# EAGLE design PoE_mag_main_alt2 (EAGLE 6.4)

## Sheet 1 of 4
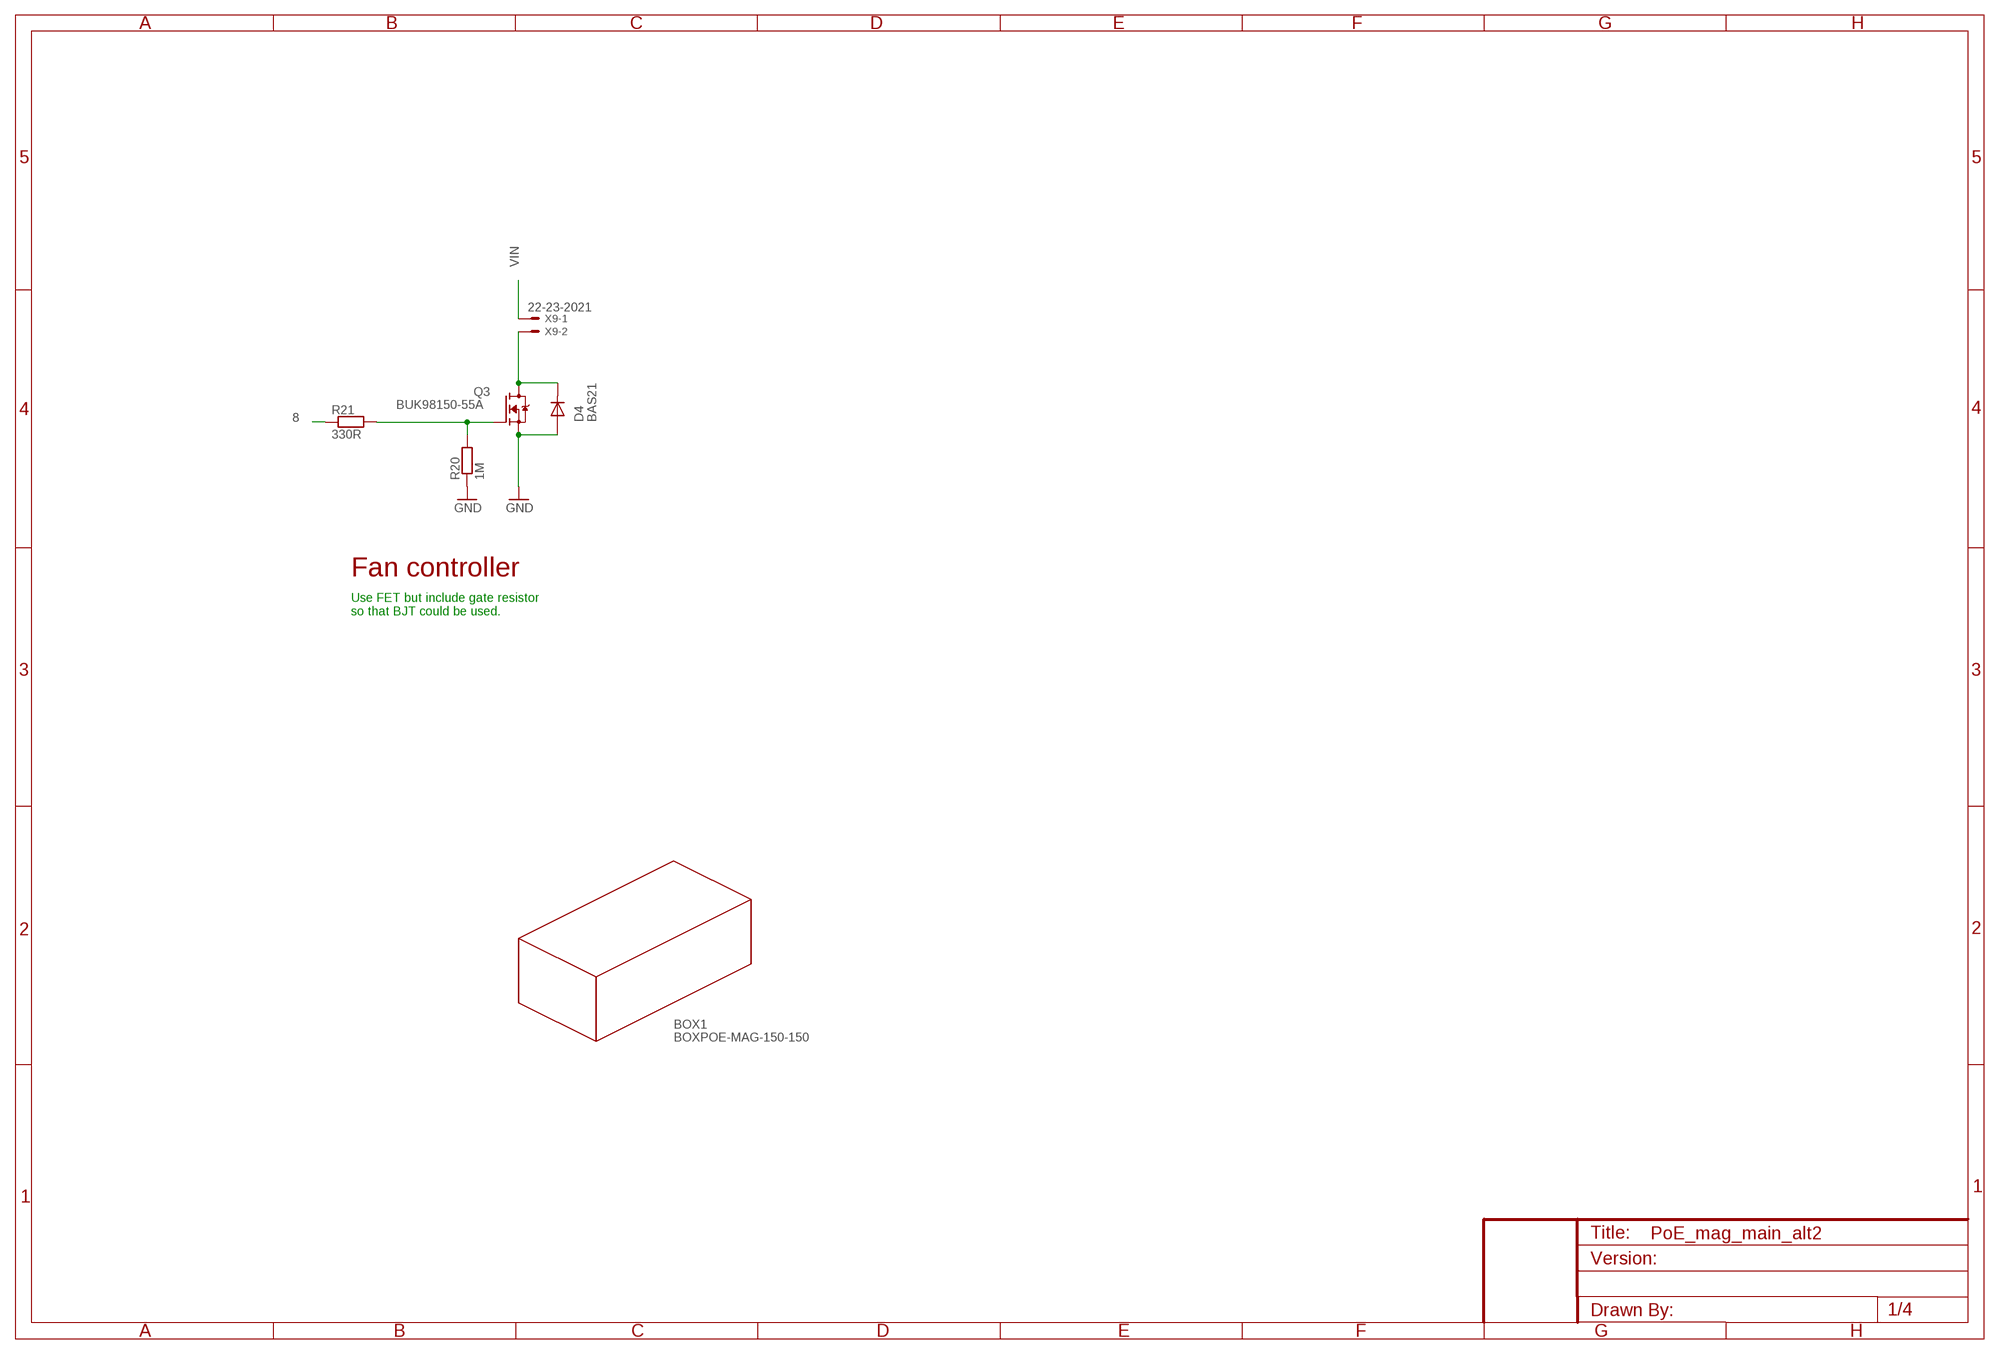
[diagram p0: schematic, sheet 1]

### Parts
BOX1  BOXPOE-MAG-150-150  [FIBOX-PC-M-95-G-POE-MAG]
D4  BAS21  DIODESOT23-1-3-HAND  [SOT23-3-HAND]
Q3  BUK98150-55A  FET-N-TYPESOT223-HAND  [SOT223-HAND]
R20  1M  RESISTOR1206-HAND  [1206-HAND]
R21  330R  RESISTOR1206-HAND  [1206-HAND]
X9  22-23-2021  [22-23-2021]

### Nets
8: R21.1 ; also sheet 2
FAN_CTRL: D4.3(C) Q3.2(D) Q3.4(D) X9.2
GND [power]: D4.1(A) Q3.3(S) R20.1 ; also sheet 2,3,4
N$29: Q3.1(G) R20.2 R21.2
VIN [power]: X9.1 ; also sheet 2,4

### Notes on the sheet
- Fan controller
- Use FET but include gate resistor
  so that BJT could be used.

## Sheet 2 of 4
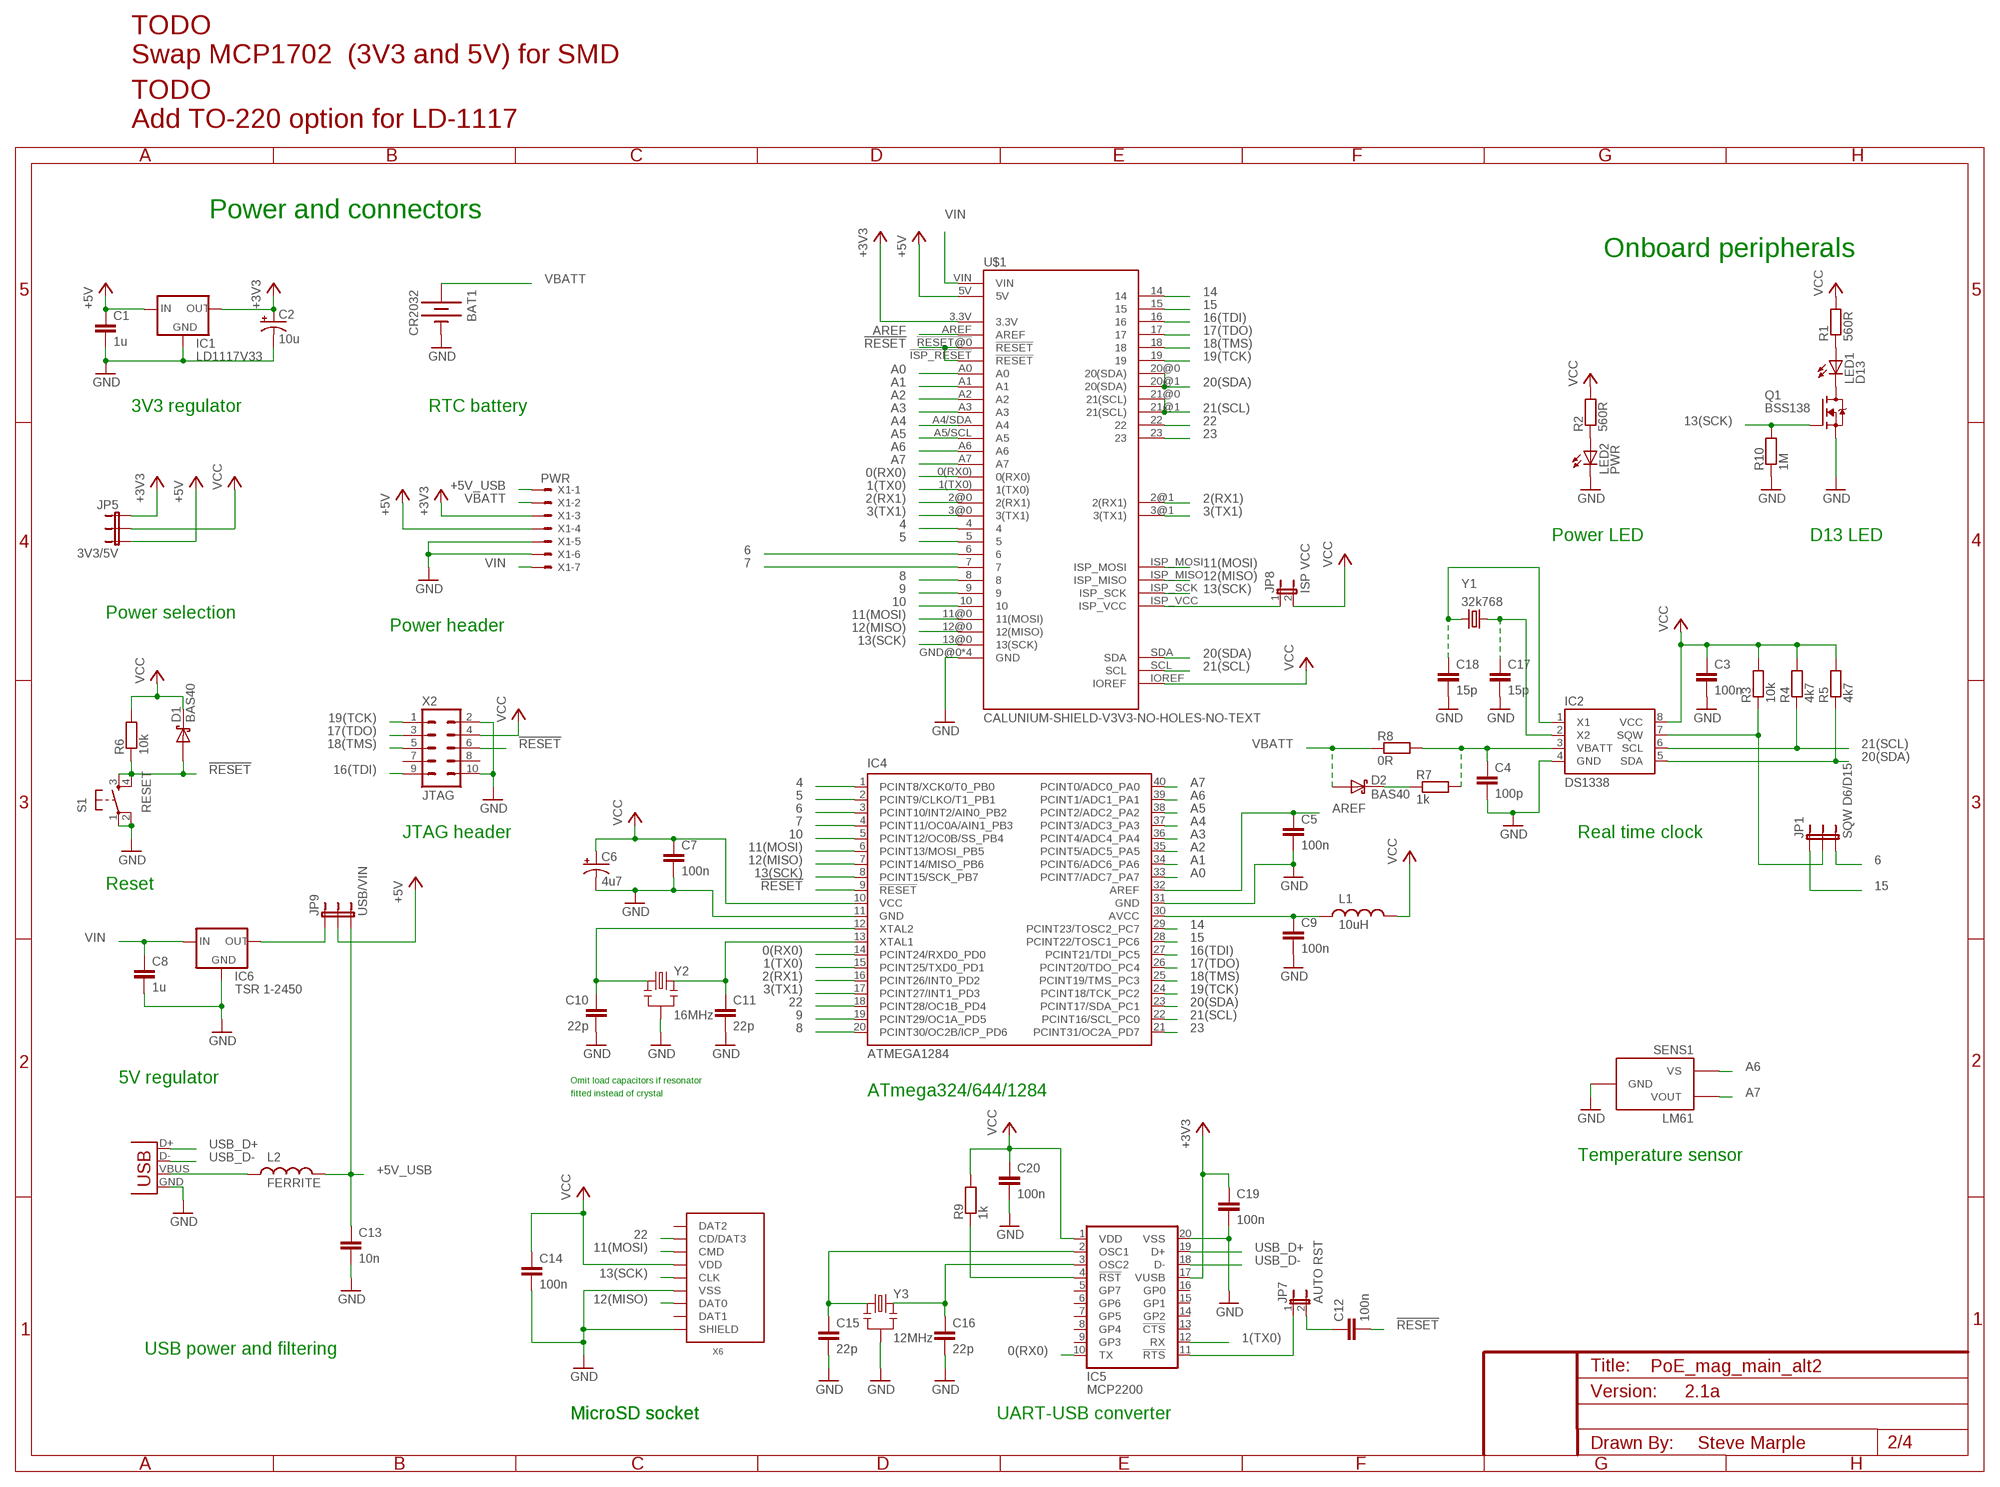
[diagram p1: schematic, sheet 2]

### Parts
BAT1  CR2032  BATTERY20PTH  [BATTCOM_20MM_PTH]
C1  1u  C-EU1206-HAND  [1206-HAND]
C2  10u  CAP_POLPTH2  [CPOL-RADIAL-10UF-25V]
C3  100n  C-EU1206-HAND  [1206-HAND]
C4  100p  C-EU1206-HAND  [1206-HAND]
C5  100n  C-EU1206-HAND  [1206-HAND]
C6  4u7  CAP_POLPTH2  [CPOL-RADIAL-10UF-25V]
C7  100n  C-EU1206-HAND  [1206-HAND]
C8  1u  C-EU1206-HAND  [1206-HAND]
C9  100n  C-EU1206-HAND  [1206-HAND]
C10  22p  C-EU0805-HAND  [0805-HAND]
C11  22p  C-EU0805-HAND  [0805-HAND]
C12  100n  C-EU1206-HAND  [1206-HAND]
C13  10n  C-EU1206-HAND  [1206-HAND]
C14  100n  C-EU1206-HAND  [1206-HAND]
C15  22p  C-EU0805-HAND  [0805-HAND]
C16  22p  C-EU0805-HAND  [0805-HAND]
C17  15p  C-EU0805-HAND  [0805-HAND]
C18  15p  C-EU0805-HAND  [0805-HAND]
C19  100n  C-EU1206-HAND  [1206-HAND]
C20  100n  C-EU1206-HAND  [1206-HAND]
D1  BAS40  DIODE-SCHOTTKYSOT23-1-3-HAND  [SOT23-3-HAND]
D2  BAS40  DIODE-SCHOTTKYSOT23-1-3-HAND  [SOT23-3-HAND]
IC1  LD1117V33  V_REG_LD1117VXXTO220  [TO220]
IC2  DS1338  DS1307SO08  [SO08]
IC4  ATMEGA1284  ATMEGA644-20PU  [DIL40]
IC5  MCP2200  [SO20]
IC6  TSR 1-2450  V_REG_78XXTSR-1-XXXX  [TSR-1-XXXX]
JP1  SQW D6/D15  JUMPER-3PTH  [1X03]
JP5  3V3/5V  JUMPER-3PTH  [1X03]
JP7  AUTO RST  JUMPER-2PTH  [1X02]
JP8  ISP VCC  JUMPER-2PTH  [1X02]
JP9  USB/VIN  JUMPER-3PTH  [1X03]
L1  10uH  INDUCTOR1210-HAND  [1210-HAND]
L2  FERRITE  INDUCTOR0805-HAND  [0805-HAND]
LED1  D13  LED3MM  [LED3MM]
LED2  PWR  LED3MM  [LED3MM]
Q1  BSS138  BSS138SOT23-3-HAND  [SOT23-3-HAND]
R1  560R  RESISTOR1206-HAND  [1206-HAND]
R2  560R  RESISTOR1206-HAND  [1206-HAND]
R3  10k  RESISTOR1206-HAND  [1206-HAND]
R4  4k7  RESISTOR1206-HAND  [1206-HAND]
R5  4k7  RESISTOR1206-HAND  [1206-HAND]
R6  10k  RESISTOR1206-HAND  [1206-HAND]
R7  1k  RESISTOR1206-HAND  [1206-HAND]
R8  0R  RESISTOR1206-HAND  [1206-HAND]
R9  1k  RESISTOR1206-HAND  [1206-HAND]
R10  1M  RESISTOR1206-HAND  [1206-HAND]
S1  RESET  TAC_SWITCHPTH  [TACTILE-PTH]
SENS1  LM61  [TO-92]
U$1  CALUNIUM-SHIELD-V3V3-NO-HOLES-NO-TEXT  [CALUNIUM-SHIELD-NO-OUTLINE-NO-HOLES-NO-TEXT-V3]
X1  PWR  22-23-2071  [22-23-2071]
X2  JTAG  ATMEL-JTAG  [CON-HARTING-ML10]
X3  USB  USBPTH-VERTICAL  [USB-B-PTH-VERTICAL]
X6  MICRO-SD-SOCKETHIROSE-DM3D  [MICRO-SD-SOCKET-HIROSE-DM3D]
Y1  32k768  CRYSTALTC38H  [TC38H]
Y2  16MHz  CRYSTAL-RESONATOR  [HC49U-V-RESONATOR]
Y3  12MHz  CRYSTAL-RESONATOR  [HC49U-V-RESONATOR]

### Nets
0(RX0): IC4.14(PCINT24/RXD0_PD0) IC5.10(TX) U$1.0(RX0)
1(TX0): IC4.15(PCINT25/TXD0_PD1) IC5.12(RX) U$1.1(TX0)
2(RX1): IC4.16(PCINT26/INT0_PD2) U$1.2@0(2(RX1)) U$1.2@1(2(RX1)) ; also sheet 3
3(TX1): IC4.17(PCINT27/INT1_PD3) U$1.3@0(3(TX1)) U$1.3@1(3(TX1)) ; also sheet 3
4: IC4.1(PCINT8/XCK0/T0_PB0) U$1.4
5: IC4.2(PCINT9/CLKO/T1_PB1) U$1.5
6: IC4.3(PCINT10/INT2/AIN0_PB2) JP1.3 U$1.6 ; also sheet 3
7: IC4.4(PCINT11/OC0A/AIN1_PB3) U$1.7 ; also sheet 3
8: IC4.20(PCINT30/OC2B/ICP_PD6) U$1.8 ; also sheet 1
9: IC4.19(PCINT29/OC1A_PD5) U$1.9
10: IC4.5(PCINT12/OC0B/SS_PB4) U$1.10
11(MOSI): IC4.6(PCINT13/MOSI_PB5) U$1.11@0(11(MOSI)) U$1.ISP_MOSI X6.CMD
12(MISO): IC4.7(PCINT14/MISO_PB6) U$1.12@0(12(MISO)) U$1.ISP_MISO X6.DAT0
13(SCK): IC4.8(PCINT15/SCK_PB7) Q1.1(G) R10.2 U$1.13@0(13(SCK)) U$1.ISP_SCK X6.CLK
14: IC4.29(PCINT23/TOSC2_PC7) U$1.14
15: IC4.28(PCINT22/TOSC1_PC6) JP1.1 U$1.15
16(TDI): IC4.27(PCINT21/TDI_PC5) U$1.16 X2.9(TDI)
17(TDO): IC4.26(PCINT20/TDO_PC4) U$1.17 X2.3(TDO)
18(TMS): IC4.25(PCINT19/TMS_PC3) U$1.18 X2.5(TMS)
19(TCK): IC4.24(PCINT18/TCK_PC2) U$1.19 X2.1(TCK)
20(SDA): IC2.5(SDA) IC4.23(PCINT17/SDA_PC1) R5.1 U$1.20@0(20(SDA)) U$1.20@1(20(SDA)) U$1.SDA ; also sheet 4
21(SCL): IC2.6(SCL) IC4.22(PCINT16/SCL_PC0) R4.1 U$1.21@0(21(SCL)) U$1.21@1(21(SCL)) U$1.SCL ; also sheet 4
22: IC4.18(PCINT28/OC1B_PD4) U$1.22 X6.CD/DAT3
23: IC4.21(PCINT31/OC2A_PD7) U$1.23
!MCP2200_RESET: IC5.4(!RST) R9.1
!RESET: C12.2 D1.1(A) IC4.9(!RESET) R6.1 S1.3 S1.4 U$1.!ISP_RESET(!RESET) U$1.!RESET@0(!RESET) X2.6(!SRST)
+3V3 [power]: C2.1(+) C19.1 IC1.2(OUT) IC5.17(VUSB) JP5.1 U$1.3.3V X1.3 ; also sheet 3,4
+5V [power]: C1.1 IC1.3(IN) JP5.3 JP9.2 U$1.5V X1.4 ; also sheet 3,4
+5V_USB [power]: C13.1 JP9.3 L2.2 X1.1
A0: IC4.33(PCINT7/ADC7_PA7) U$1.A0 ; also sheet 3
A1: IC4.34(PCINT6/ADC6_PA6) U$1.A1
A2: IC4.35(PCINT5/ADC5_PA5) U$1.A2 ; also sheet 4
A3: IC4.36(PCINT4/ADC4_PA4) U$1.A3
A4: IC4.37(PCINT3/ADC3_PA3) U$1.A4/SDA(A4)
A5: IC4.38(PCINT2/ADC2_PA2) U$1.A5/SCL(A5)
A6: IC4.39(PCINT1/ADC1_PA1) SENS1.1(VS) U$1.A6
A7: IC4.40(PCINT0/ADC0_PA0) SENS1.2(VOUT) U$1.A7
AREF: C5.1 IC4.32(AREF) U$1.AREF
AUTO_RESET: IC5.11(!RTS) JP7.1
AVCC [power]: C9.1 IC4.30(AVCC) L1.1
GND [power]: BAT1.2(-) C1.2 C2.2(-) C3.2 C4.2 C5.2 C6.2(-) C7.2 C8.2 C9.2 C10.2 C11.2 C13.2 C14.2 C15.2 C16.2 C17.2 C18.2 C19.2 C20.2 IC1.1(GND) IC2.4(GND) IC4.11(GND) IC4.31(GND) IC5.20(VSS) IC6.GND LED2.K(C) Q1.2(S) R10.1 S1.1 S1.2 SENS1.3(GND) U$1.GND@0(GND) U$1.GND@1(GND) U$1.GND@2(GND) U$1.GND@3(GND) X1.5 X1.6 X2.2(GND) X2.10(GND) X3.GND X6.GND(VSS) X6.SHIELD@0(SHIELD) Y2.GND Y3.GND ; also sheet 1,3,4
N$1: C11.1 IC4.13(XTAL1) Y2.2
N$2: C10.1 IC4.12(XTAL2) Y2.1
N$3: LED1.A R1.1
N$4: LED1.K(C) Q1.3(D)
N$5: C18.1 IC2.1(X1) Y1.2
N$6 [power]: JP8.1 U$1.ISP_VCC
N$7: C16.1 IC5.3(OSC2) Y3.2
N$8: LED2.A R2.1
N$9: D2.3(C) R7.1
N$11: C4.1 IC2.3(VBATT) R7.2 R8.2
N$12: C17.1 IC2.2(X2) Y1.1
N$14: IC6.OUT JP9.1
N$15: C12.1 JP7.2
N$18: C15.1 IC5.2(OSC1) Y3.1
SQW: IC2.7(SQW) JP1.2 R3.1
USB_D+: IC5.19(D+) X3.D+
USB_D-: IC5.18(D-) X3.D-
VBATT: BAT1.1(+) D2.1(A) R8.1 X1.2 ; also sheet 3
VBUS [power]: L2.1 X3.VBUS
VCC [power]: C3.1 C6.1(+) C7.1 C14.1 C20.1 D1.3(C) IC2.8(VCC) IC4.10(VCC) IC5.1(VDD) JP5.2 JP8.2 L1.2 R1.2 R2.2 R3.2 R4.2 R5.2 R6.2 R9.2 U$1.IOREF X2.4(VTREF) X6.VDD ; also sheet 3,4
VIN [power]: C8.1 IC6.IN U$1.VIN X1.7 ; also sheet 1,4
Unconnected: IC5.5(GP7) IC5.6(GP6) IC5.7(GP5) IC5.8(GP4) IC5.9(GP3) IC5.13(!CTS) IC5.14(GP2) IC5.15(GP1) IC5.16(GP0) X2.7(NC) X2.8(NC) X6.DAT1 X6.DAT2

### Notes on the sheet
- TODO
  Swap MCP1702  (3V3 and 5V) for SMD
- TODO
  Add TO-220 option for LD-1117
- Power and connectors
- Onboard peripherals
- 3V3 regulator | RTC battery
- Power LED | D13 LED
- Power selection
- Power header
- JTAG header | Real time clock
- Reset
- 5V regulator | Omit load capacitors if resonator
- fitted instead of crystal | ATmega324/644/1284
- Temperature sensor
- USB power and filtering
- 2.1a
- MicroSD socket | MicroSD socket | UART-USB converter
- Steve Marple

## Sheet 3 of 4
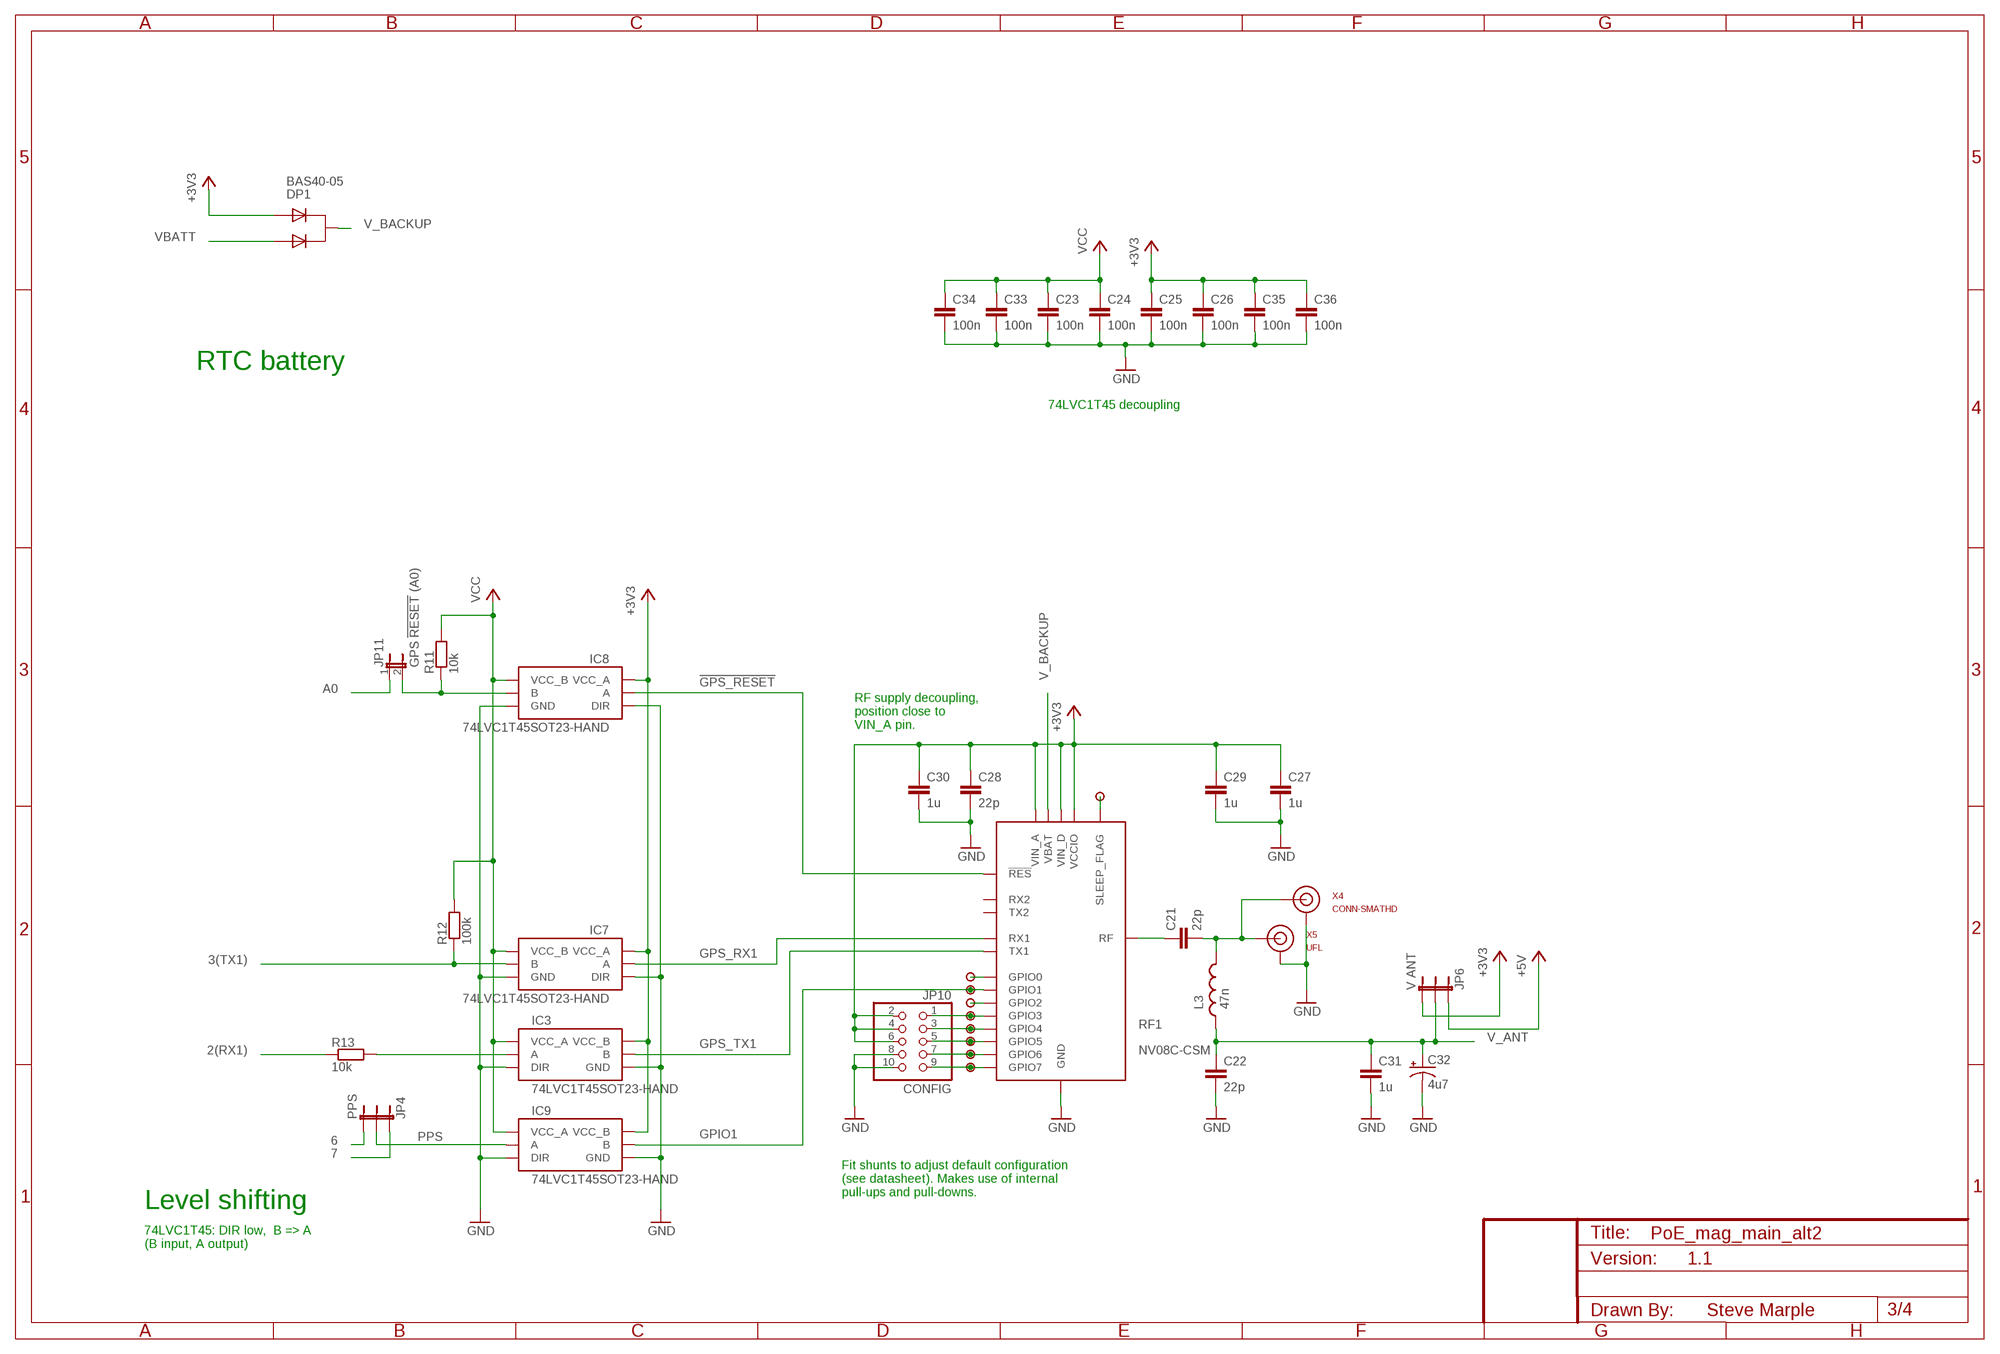
[diagram p2: schematic, sheet 3]

### Parts
C21  22p  C-EU0805-HAND  [0805-HAND]
C22  22p  C-EU0805-HAND  [0805-HAND]
C23  100n  C-EU1206-HAND  [1206-HAND]
C24  100n  C-EU1206-HAND  [1206-HAND]
C25  100n  C-EU1206-HAND  [1206-HAND]
C26  100n  C-EU1206-HAND  [1206-HAND]
C27  1u  C-EU1206-HAND  [1206-HAND]
C28  22p  C-EU0805-HAND  [0805-HAND]
C29  1u  C-EU1206-HAND  [1206-HAND]
C30  1u  C-EU1206-HAND  [1206-HAND]
C31  1u  C-EU1206-HAND  [1206-HAND]
C32  4u7  CAP_POLPTH2  [CPOL-RADIAL-10UF-25V]
C33  100n  C-EU1206-HAND  [1206-HAND]
C34  100n  C-EU1206-HAND  [1206-HAND]
C35  100n  C-EU1206-HAND  [1206-HAND]
C36  100n  C-EU1206-HAND  [1206-HAND]
DP1  BAS40-05  DIODE-PAIR-COMMON-CATHODE  [SOT23-3-HAND]
IC3  74LVC1T45SOT23-HAND  [SOT23-6-HAND]
IC7  74LVC1T45SOT23-HAND  [SOT23-6-HAND]
IC8  74LVC1T45SOT23-HAND  [SOT23-6-HAND]
IC9  74LVC1T45SOT23-HAND  [SOT23-6-HAND]
JP4  PPS  JUMPER-3PTH  [1X03]
JP6  V ANT  JUMPER-3PTH  [1X03]
JP10  CONFIG  PINHD-2X5  [2X05]
JP11  GPS !RESET! (A0)  JUMPER-2PTH  [1X02]
L3  47n  INDUCTOR0805-HAND  [0805-HAND]
R11  10k  RESISTOR1206-HAND  [1206-HAND]
R12  100k  RESISTOR1206-HAND  [1206-HAND]
R13  10k  RESISTOR1206-HAND  [1206-HAND]
RF1  NV08C-CSM  NV08C-CSMHAND  [NVC08C-CSM-HAND]
U$2  PAD  [PAD]
U$3  PAD  [PAD]
U$4  PAD  [PAD]
U$5  ?  PAD  [PAD]
U$6  PAD  [PAD]
U$7  PAD  [PAD]
U$8  PAD  [PAD]
U$9  PAD  [PAD]
U$10  PAD  [PAD]
X4  CONN-SMATHD  [SMA-THD]
X5  UFL  CONN-UFLHAND  [CONN-UFL-HAND-SOLDERING]

### Nets
2(RX1): R13.1 ; also sheet 2
3(TX1): IC7.4(B) R12.1 ; also sheet 2
6: JP4.3 ; also sheet 2
7: JP4.1 ; also sheet 2
!GPS_RESET: IC8.3(A) RF1.P$25(!RES)
+3V3 [power]: C25.1 C26.1 C27.1 C28.1 C29.1 C30.1 C35.1 C36.1 DP1.2(A2) IC3.6(VCC_B) IC7.1(VCC_A) IC8.1(VCC_A) IC9.6(VCC_B) JP6.3 JP10.2 JP10.4 JP10.6 RF1.P$8(VIN_A) RF1.P$26(VIN_D) RF1.P$28(VCCIO) ; also sheet 2,4
+5V [power]: JP6.1 ; also sheet 2,4
A0: JP11.1 ; also sheet 2
GND [power]: C22.2 C23.2 C24.2 C25.2 C26.2 C27.2 C28.2 C29.2 C30.2 C31.2 C32.2(-) C33.2 C34.2 C35.2 C36.2 IC3.2(GND) IC3.5(DIR) IC7.2(GND) IC7.5(DIR) IC8.2(GND) IC8.5(DIR) IC9.2(GND) IC9.5(DIR) JP10.8 JP10.10 RF1.P$3(GND) RF1.P$9(GND) RF1.P$10(GND) RF1.P$11(GND) RF1.P$12(GND) RF1.P$13(GND) RF1.P$14(GND) RF1.P$16(GND) RF1.P$17(GND) RF1.P$18(GND) RF1.P$19(GND) RF1.P$22(GND) RF1.P$24(GND) RF1.P$27(GND) RF1.P$29(GND) RF1.P$34(GND) X4.GND@0(GND) X4.GND@1(GND) X4.GND@2(GND) X4.GND@3(GND) X5.GND@0(GND) X5.GND@1(GND) ; also sheet 1,2,4
GPIO0: RF1.P$20(GPIO0) U$3.1
GPIO1: IC9.4(B) RF1.P$2(GPIO1) U$4.1
GPIO2: RF1.P$1(GPIO2) U$5.1
GPIO3: JP10.1 RF1.P$6(GPIO3) U$6.1
GPIO4: JP10.3 RF1.P$7(GPIO4) U$7.1
GPIO5: JP10.5 RF1.P$4(GPIO5) U$8.1
GPIO6: JP10.7 RF1.P$35(GPIO6) U$9.1
GPIO7: JP10.9 RF1.P$5(GPIO7) U$10.1
GPS_RX1: IC7.3(A) RF1.P$33(RX1)
GPS_TX1: IC3.4(B) RF1.P$32(TX1)
N$22: IC8.4(B) JP11.2 R11.1
N$23 [antenna]: C21.2 L3.2 X4.SIG(SIGNAL) X5.SIGNAL
N$24 [antenna]: C21.1 RF1.P$15(RF)
N$25: IC3.3(A) R13.2
PPS: IC9.3(A) JP4.2
SLEEP_FLAG: RF1.P$21(SLEEP_FLAG) U$2.1
V_ANT [power]: C22.1 C31.1 C32.1(+) JP6.2 L3.1
V_BACKUP: DP1.3(C) RF1.P$23(VBAT)
VBATT: DP1.1(A1) ; also sheet 2
VCC [power]: C23.1 C24.1 C33.1 C34.1 IC3.1(VCC_A) IC7.6(VCC_B) IC8.6(VCC_B) IC9.1(VCC_A) R11.2 R12.2 ; also sheet 2,4
Unconnected: RF1.P$30(RX2) RF1.P$31(TX2)

### Notes on the sheet
- RTC battery
- 74LVC1T45 decoupling
- RF supply decoupling,
  position close to
  VIN_A pin.
- Fit shunts to adjust default configuration
  (see datasheet). Makes use of internal
  pull-ups and pull-downs.
- Level shifting
- 74LVC1T45: DIR low,  B => A
  (B input, A output)
- 1.1
- Steve Marple

## Sheet 4 of 4
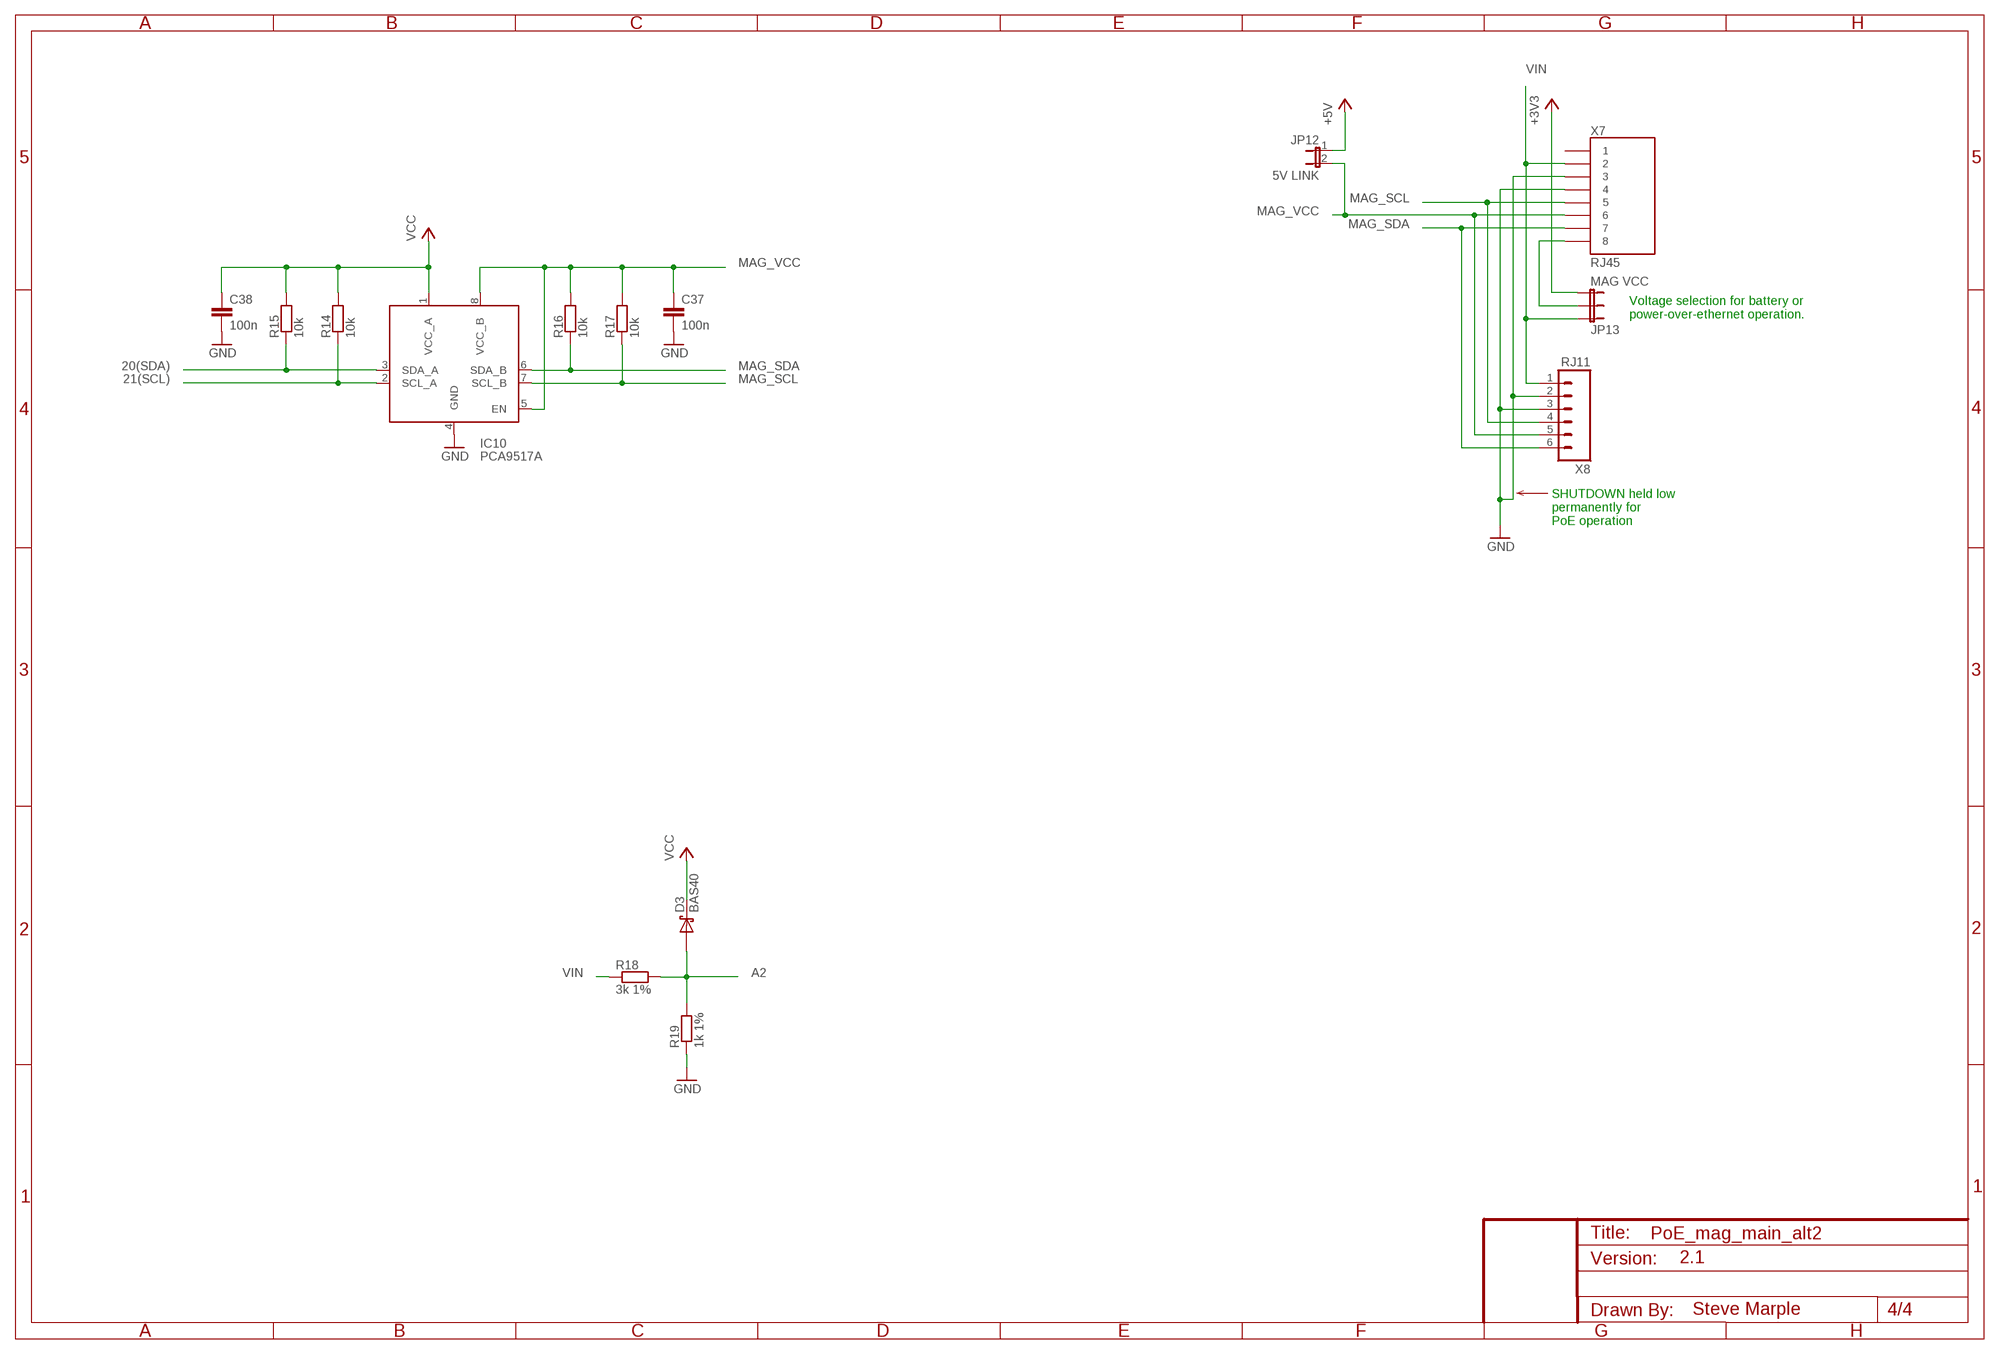
[diagram p3: schematic, sheet 4]

### Parts
C37  100n  C-EU1206-HAND  [1206-HAND]
C38  100n  C-EU1206-HAND  [1206-HAND]
D3  BAS40  DIODE-SCHOTTKYSOT23-1-3-HAND  [SOT23-3-HAND]
IC10  PCA9517A  PCA9517ASOIC  [SO08]
JP12  5V LINK  JUMPER-2PTH  [1X02]
JP13  MAG VCC  JUMPER-3PTH  [1X03]
R14  10k  RESISTOR1206-HAND  [1206-HAND]
R15  10k  RESISTOR1206-HAND  [1206-HAND]
R16  10k  RESISTOR1206-HAND  [1206-HAND]
R17  10k  RESISTOR1206-HAND  [1206-HAND]
R18  3k 1%  RESISTOR1206-HAND  [1206-HAND]
R19  1k 1%  RESISTOR1206-HAND  [1206-HAND]
X7  RJ45  RJ45-8PTH  [RJ45-8]
X8  RJ11  RJ11-6PTH  [RJ11-6]

### Nets
20(SDA): IC10.3(SDA_A) R15.1 ; also sheet 2
21(SCL): IC10.2(SCL_A) R14.1 ; also sheet 2
+3V3 [power]: JP13.3 ; also sheet 2,3
+5V [power]: JP12.1 ; also sheet 2,3
A2: D3.1(A) R18.2 R19.2 ; also sheet 2
GND [power]: C37.2 C38.2 IC10.4(GND) R19.1 X7.3 X7.4 X8.2 X8.3 ; also sheet 1,2,3
MAG_SCL: IC10.7(SCL_B) R17.1 X7.5 X8.4
MAG_SDA: IC10.6(SDA_B) R16.1 X7.7 X8.6
MAG_VCC: C37.1 IC10.5(EN) IC10.8(VCC_B) JP12.2 R16.2 R17.2 X7.6 X8.5
N$26 [power]: JP13.2 X7.8
VCC [power]: C38.1 D3.3(C) IC10.1(VCC_A) R14.2 R15.2 ; also sheet 2,3
VIN [power]: JP13.1 R18.1 X7.2 X8.1 ; also sheet 1,2
Unconnected: X7.1

### Notes on the sheet
- Voltage selection for battery or
  power-over-ethernet operation.
- SHUTDOWN held low
  permanently for 
  PoE operation
- 2.1
- Steve Marple

## Library data of the parts
BAT1 = SparkFun:BATTERY: Battery Holders Various common sizes : AA, AAA, 20mm coin cell and 12mm coin cell.
BOX1 = fibox:BOX
C1 C3-C5 C7-C9 C12-C31 C33-C38 = SteveMarple:C-EU
C2 C32 = SteveMarple:CAP_POL: Capacitor Polarized These are standard SMD and PTH capacitors. Normally 10uF, 47uF, and 100uF in electrolytic and tantalum varieties. Always verify the external diameter of the through hole cap, it varies with capacity, voltage, and manufacturer. The EIA devices should be standard.
C6 = SparkFun:CAP_POL: Capacitor Polarized These are standard SMD and PTH capacitors. Normally 10uF, 47uF, and 100uF in electrolytic and tantalum varieties. Always verify the external diameter of the through hole cap, it varies with capacity, voltage, and manufacturer. The EIA devices should be standard.
C10 C11 = SteveMarple:C-EU; OPTION: Do not fit for ceramic resonator
D1-D3 = SteveMarple:DIODE-SCHOTTKY
D4 = SteveMarple:DIODE
DP1 = SteveMarple:DIODE-PAIR-COMMON-CATHODE
IC1 = SteveMarple:V_REG_LD1117VXX: LD1117VXX voltage regulator CHECK PINOUT!!!!!!!!!!!!!!!!!!!
IC2 = SteveMarple:DS1307
IC3 IC7-IC9 = SteveMarple:74LVC1T45
IC4 = SteveMarple:ATMEGA644-*PU: 8-bit Microcontroller with 64K Bytes In-System Programmable Flash Auto generated by make-symbol-device-package-bsdl.ulp Rev. 34 Source: http://www.atmel.com/dyn/resources/prod_documents/doc2593.pdf; MPN: ATMEGA644-20PU; OC_FARNELL: 1288340; OC_NEWARK: 23M5060
IC5 = SteveMarple:MCP2200: MCP2200 Microchip USB-UART interface.
IC6 = SteveMarple:V_REG_78XX: Voltage Regulator Standard 7805 5V regulator. IGO (Input Ground Output). Spark Fun Electronics SKU : COM-00107
IC10 = SteveMarple:PCA9517A
JP1 JP4-JP6 JP9 JP13 = SparkFun:JUMPER-3
JP7 JP8 JP11 JP12 = SparkFun:JUMPER-2: Jumper Basic 0.1" spaced jumper. Use with breakaway headers.
JP10 = pinhead:PINHD-2X5: PIN HEADER
L1-L3 = SteveMarple:INDUCTOR: Inductors Basic Inductor/Choke - 0603 and 1206. Footprints are not proven and vary greatly between part numbers.
LED1 LED2 = SparkFun:LED: LEDs Standard schematic elements and footprints for 5mm, 3mm, 1206, and 0603 sized LEDs. 5mm - Spark Fun Electronics SKU : COM-00529 (and others)
Q1 = SteveMarple:BSS138: BSS138 FET
Q3 = SteveMarple:FET-N-TYPE
R1-R21 = SteveMarple:RESISTOR: 1/4W PTH resistor
RF1 = nvs-tech:NV08C-CSM
S1 = SparkFun:TAC_SWITCH: Momentary Switch Button commonly used for reset or general input. Spark Fun Electronics SKU : COM-00097
SENS1 = SteveMarple:LM61
U$1 = SteveMarple:CALUNIUM-SHIELD-V3
U$2-U$10 = SteveMarple:PAD
X1 = con-molex:22-23-2071: .100" (2.54mm) Center Header - 7 Pin; MF: MOLEX; MPN: 22-23-2071; OC_FARNELL: 1654534; OC_NEWARK: 56H0445
X2 = SteveMarple:ATMEL-JTAG: ATMEL JTAG header
X3 = SteveMarple:USB: USB Connectors USB-B-PTH is fully proven SKU : PRT-00139 USB-miniB is fully proven SKU : PRT-00587 USB-A-PCB is untested. USB-A-H is throughly reviewed, but untested. Spark Fun Electronics SKU : PRT-00437 USB-B-SMT is throughly reviewed, but untested. Needs silkscreen touching up. USB-A-S has not been used/tested USB-MB-H has not been used/tested
X4 = SteveMarple:CONN-SMA: SMA connector
X5 = SteveMarple:CONN-UFL
X6 = SteveMarple:MICRO-SD-SOCKET
X7 = SteveMarple:RJ45-8: RJ45 Jack Simple RJ45, 8-pin connection - connector for common Cat5, Cat5e, and Cat6 Ethernet cables. Footprint not yet proven in production. Connector sku is PRT-00643; Breakout PCB sku is BOB-00716.
X8 = SteveMarple:RJ11-6: RJ11 Jack Simple 6 pin RJ11 jack. Commonly found on CAT3 devices and Microchip programmers. SKU: PRT-00132
X9 = con-molex:22-23-2021: .100" (2.54mm) Center Header - 2 Pin; MF: MOLEX; MPN: 22-23-2021; OC_FARNELL: 1462926; OC_NEWARK: 25C3832
Y1 = SteveMarple:CRYSTAL: Crystals Various standard crystals. Proven footprints. Spark Fun Electronics SKU : COM-00534
Y2 Y3 = SteveMarple:CRYSTAL-RESONATOR: Crystal/resonator; OPTION: Crystal or ceramic resonator. Max 12MHz for 3V3 operation.

## Net classes
1 power: width 0.381 mm
2 antenna: width 0.66 mm

## Board
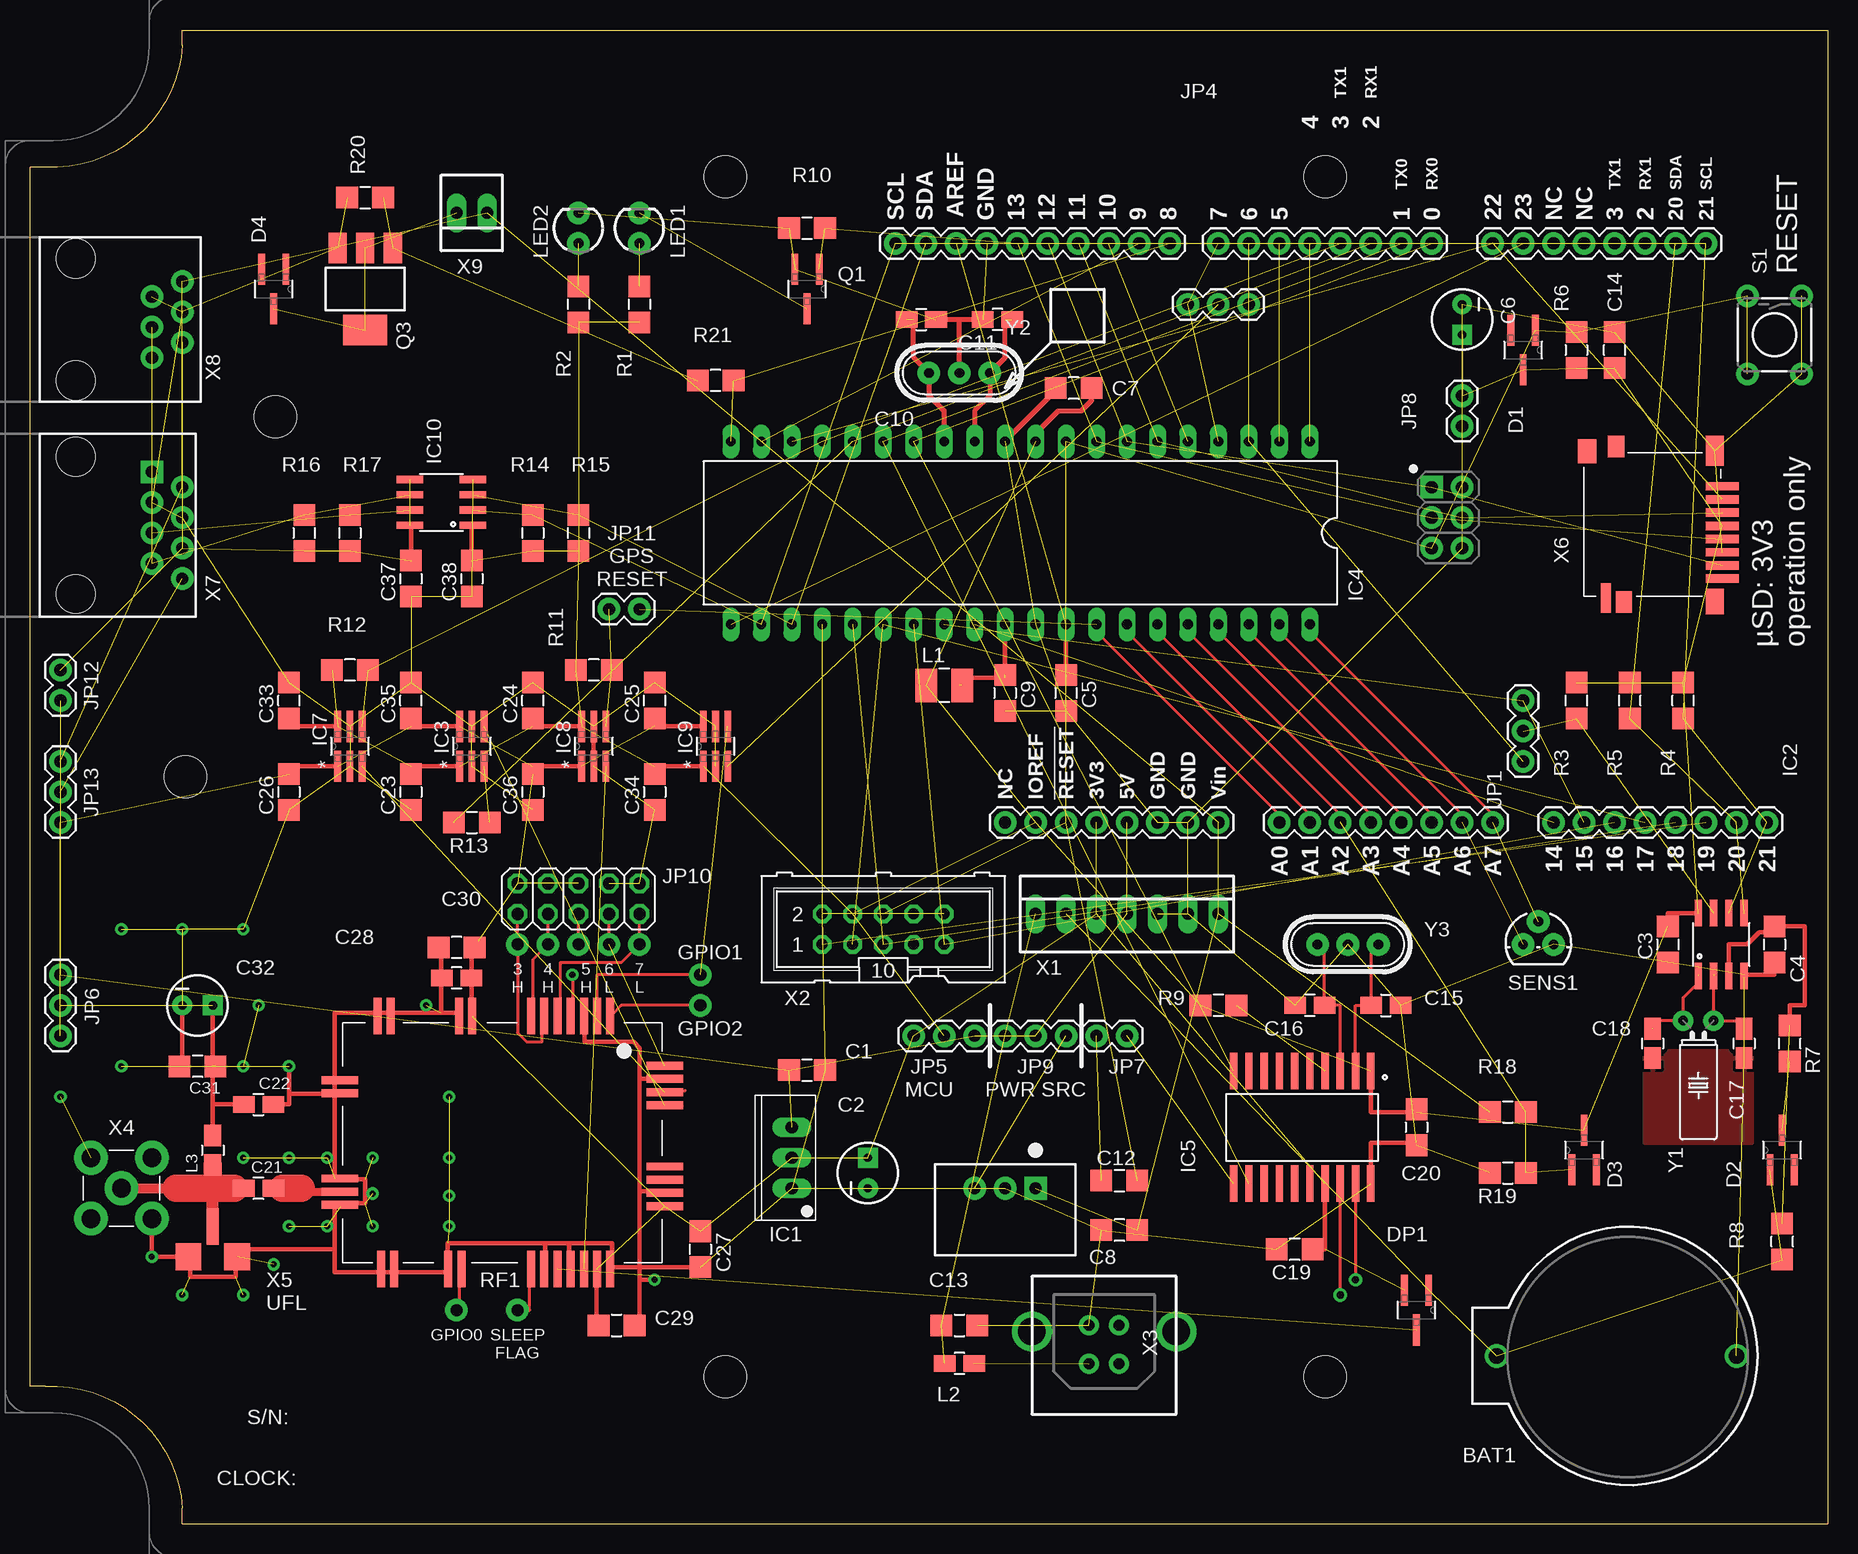
[diagram p4: board, top side]
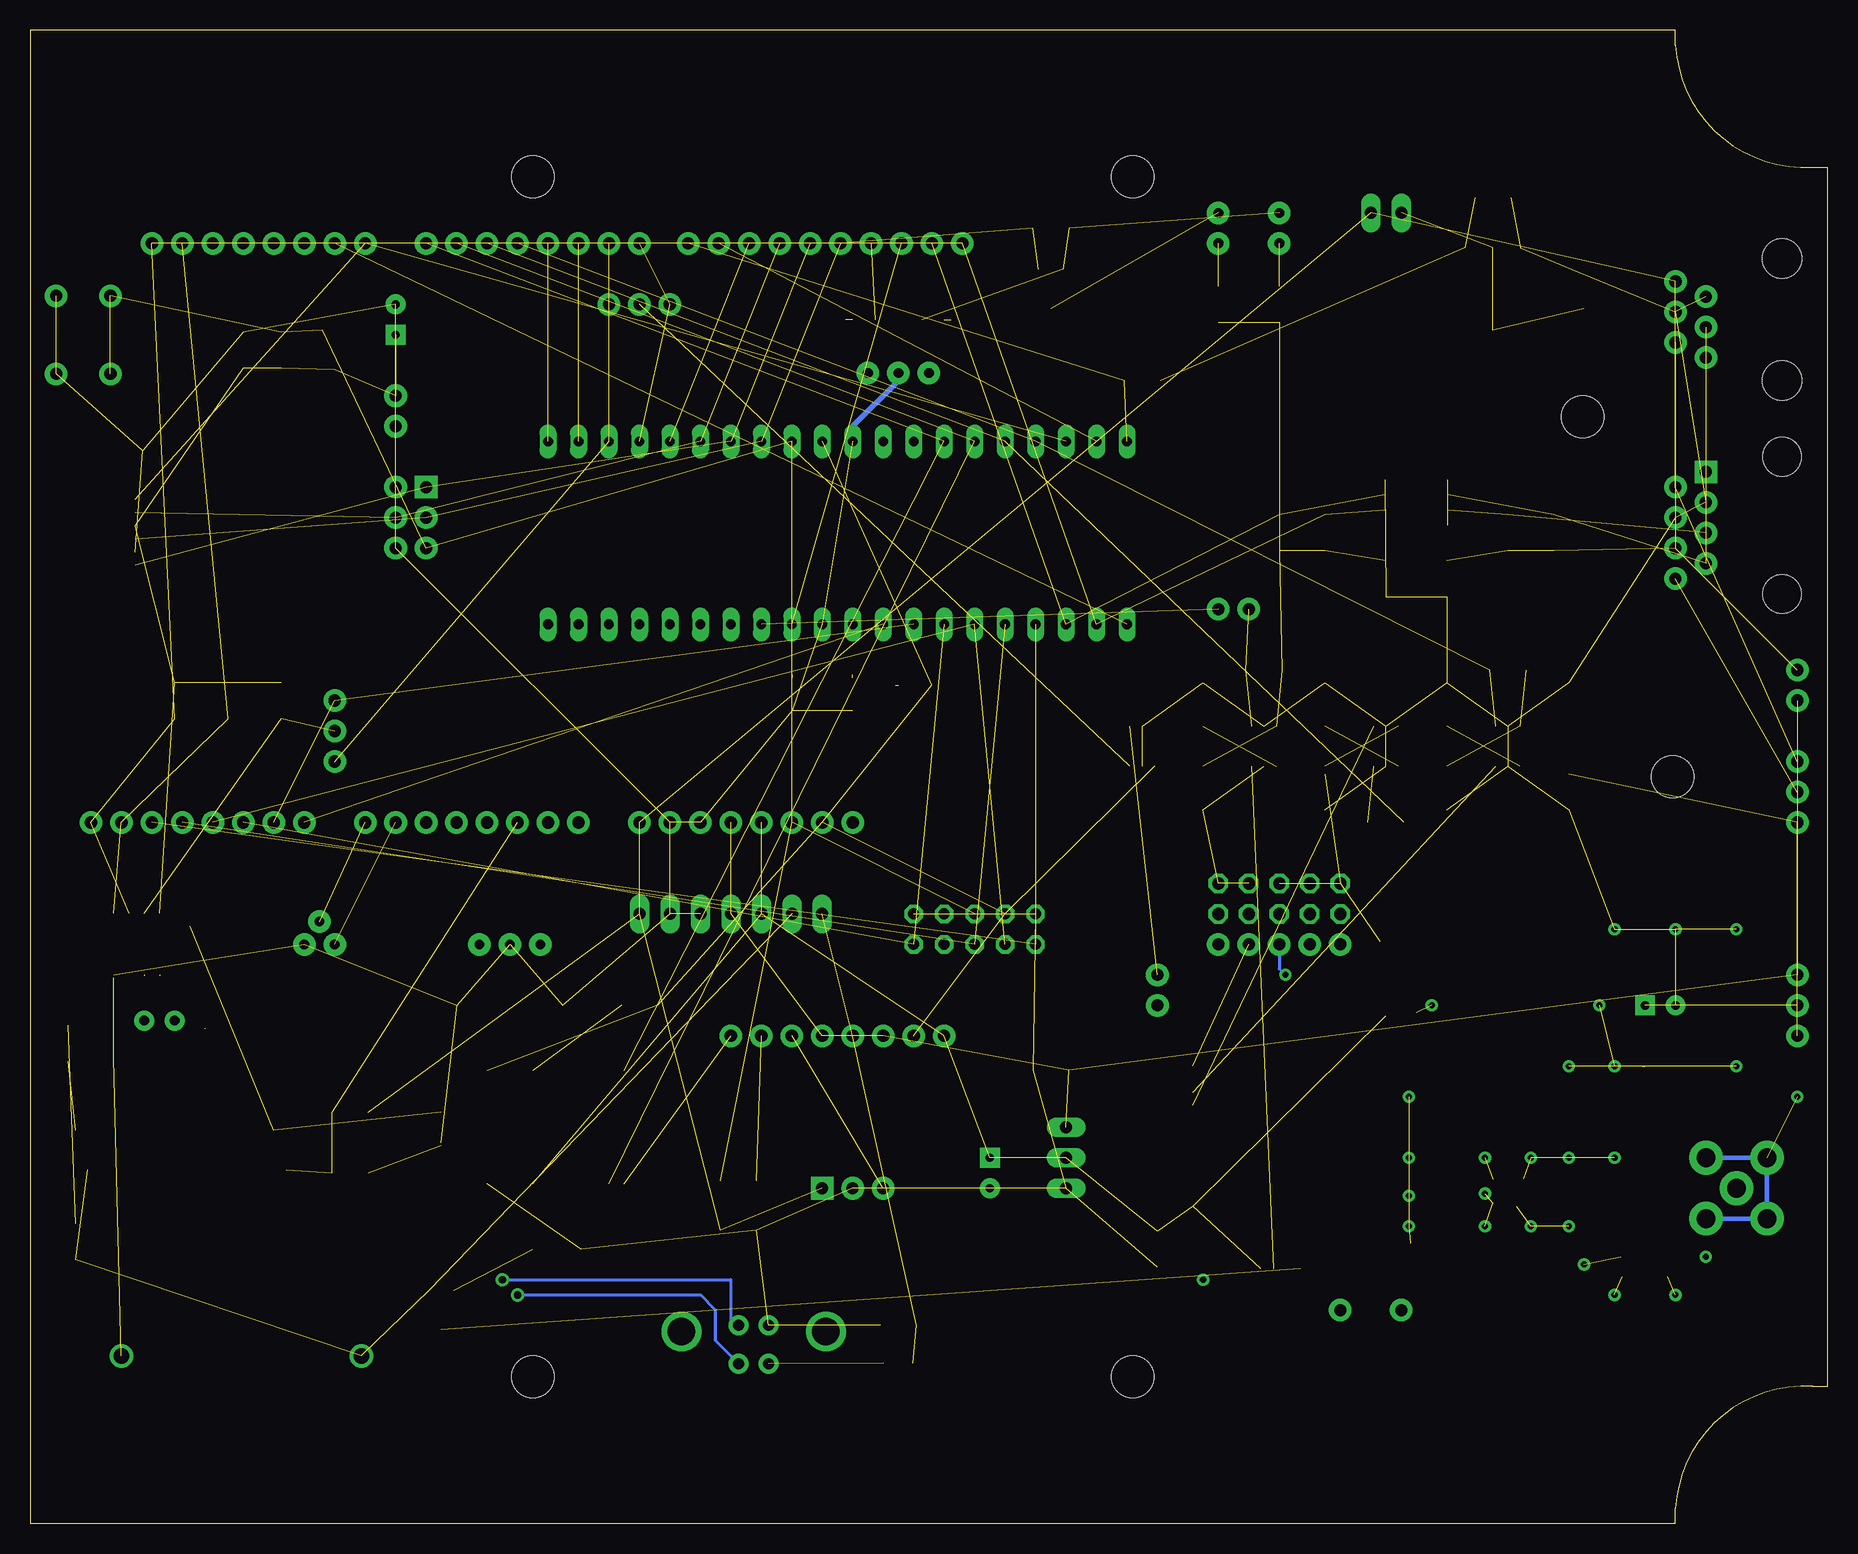
[diagram p5: board, bottom side, seen from below]

Size 149.86 x 124.46 mm. Coordinates in mm from the lower left corner, seen from the top.
Copper layers (1*16): Top 0.035mm / dielectric 1.5mm / Bottom 0.035mm
Design rules "SparkFun_Iteadstudio_10_12mil": minimum track width 10mil, minimum drill 20mil, track to track 12mil, track to pad 12mil, pad to pad 12mil, via to via 12mil, smd to smd 12mil, copper to edge 0.5mm, drill to drill 8mil, minimum pad ring 12mil, minimum via ring 10mil, stop-mask expansion 4mil, vias tented up to drill 25mil, thermal gap 10mil

### Footprints (pad centres in the part's own frame; a part is rotated, then mirrored left to right if it is on the bottom)
BATTCOM_20MM_PTH = drill 1.3: 1 20,0; 2 0,0
FIBOX-PC-M-95-G-POE-MAG = hole 3.5: 0,50; 0,-50; -50,-50; -50,50; -95,0; -87.5,30
1206-HAND = smd 1.8 x 1.803: 1 -1.499,0; 2 1.499,0
CPOL-RADIAL-10UF-25V = drill 0.7 pad 1.651 square: 1 1.27,0 | drill 0.7 pad 1.651: 2 -1.27,0
0805-HAND = smd 1.8 x 1.4: 1 -1.225,0; 2 1.225,0
SOT23-3-HAND = smd 2.591 x 0.559: 1 -1.651,1.016; 2 -1.651,-1.016; 3 1.651,0
TO220 = drill 1.016 long: 1 -2.54,0; 2 0,0; 3 2.54,0
SO08 = smd 0.61 x 2.21: 1 -1.905,-2.616; 2 -0.635,-2.616; 3 0.635,-2.616; 4 1.905,-2.616; 5 1.905,2.616; 6 0.635,2.616; 7 -0.635,2.616; 8 -1.905,2.616
SOT23-6-HAND = smd 2.591 x 0.559: 1 -1.651,1.016; 2 -1.651,0; 3 -1.651,-1.016; 4 1.651,-1.016; 5 1.651,0; 6 1.651,1.016
DIL40 = drill 0.813 long: 1 -24.13,-7.62; 2 -21.59,-7.62; 3 -19.05,-7.62; 4 -16.51,-7.62; 5 -13.97,-7.62; 6 -11.43,-7.62; 7 -8.89,-7.62; 8 -6.35,-7.62; 9 -3.81,-7.62; 10 -1.27,-7.62; 11 1.27,-7.62; 12 3.81,-7.62; 13 6.35,-7.62; 14 8.89,-7.62; 15 11.43,-7.62; 16 13.97,-7.62; 17 16.51,-7.62; 18 19.05,-7.62; 19 21.59,-7.62; 20 24.13,-7.62; 21 24.13,7.62; 22 21.59,7.62; 23 19.05,7.62; 24 16.51,7.62; 25 13.97,7.62; 26 11.43,7.62; 27 8.89,7.62; 28 6.35,7.62; 29 3.81,7.62; 30 1.27,7.62; 31 -1.27,7.62; 32 -3.81,7.62; 33 -6.35,7.62; 34 -8.89,7.62; 35 -11.43,7.62; 36 -13.97,7.62; 37 -16.51,7.62; 38 -19.05,7.62; 39 -21.59,7.62; 40 -24.13,7.62
SO20 = smd 0.61 x 3.048: 1 -5.715,-4.699; 2 -4.445,-4.699; 3 -3.175,-4.699; 4 -1.905,-4.699; 5 -0.635,-4.699; 6 0.635,-4.699; 7 1.905,-4.699; 8 3.175,-4.699; 9 4.445,-4.699; 10 5.715,-4.699; 11 5.715,4.699; 12 4.445,4.699; 13 3.175,4.699; 14 1.905,4.699; 15 0.635,4.699; 16 -0.635,4.699; 17 -1.905,4.699; 18 -3.175,4.699; 19 -4.445,4.699; 20 -5.715,4.699
TSR-1-XXXX = drill 1 pad 1.88: GND 0,0; OUT 2.54,0 | drill 1 pad 1.88 square: IN -2.54,0
1X03 = drill 1.016 pad 1.88: 1 0,0; 2 2.54,0; 3 5.08,0
1X02 = drill 1.016 pad 1.88: 1 0,0; 2 2.54,0
2X05 = drill 1.016 octagon: 1 -5.08,-1.27; 2 -5.08,1.27; 3 -2.54,-1.27; 4 -2.54,1.27; 5 0,-1.27; 6 0,1.27; 7 2.54,-1.27; 8 2.54,1.27; 9 5.08,-1.27; 10 5.08,1.27
1210-HAND = smd 1.8 x 2.794: 1 -1.499,0; 2 1.499,0
LED3MM = drill 0.813 pad 1.88: A -1.27,0; K 1.27,0
SOT223-HAND = smd 1.524 x 2.54: 1 -2.3,-3.429; 2 0,-3.429; 3 2.3,-3.429 | smd 3.683 x 2.54: 4 0,3.429
NVC08C-CSM-HAND = smd 0.66 x 3.048: P$1 -9,-10.535; P$2 -7.9,-10.535; P$3 -6.8,-10.535; P$4 -5.7,-10.535; P$5 -4.6,-10.535; P$6 -3.5,-10.535; P$7 -2.4,-10.535; P$8 2.5,-10.535; P$9 3.6,-10.535; P$10 9.3,-10.535; P$11 10.4,-10.535; P$17 10.1,10.535; P$18 9,10.535; P$19 4.5,10.535; P$20 3.4,10.535; P$21 -2.4,10.535; P$22 -3.5,10.535; P$23 -4.6,10.535; P$24 -5.7,10.535; P$25 -6.8,10.535; P$26 -7.9,10.535; P$27 -9,10.535 | smd 3.048 x 0.66: P$12 13.535,-5.2; P$13 13.535,-4.1; P$14 13.535,3; P$15 13.535,4.1; P$16 13.535,5.2; P$28 -13.535,5.3; P$29 -13.535,4.2; P$30 -13.535,3.1; P$31 -13.535,2; P$32 -13.535,-3.1; P$33 -13.535,-4.2; P$34 -13.535,-5.3; P$35 -13.535,-6.4
TACTILE-PTH = drill 1.016 pad 1.88: 1 -3.251,2.261; 2 3.251,2.261; 3 -3.251,-2.261; 4 3.251,-2.261
TO-92 = drill 0.813 pad 1.88: 1 -1.27,0; 2 0,1.905; 3 1.27,0
CALUNIUM-SHIELD-NO-OUTLINE-NO-HOLES-NO-TEXT-V3 = drill 1.016 pad 1.88: 0(RX0) 0,21.59; 1(TX0) -2.54,21.59; 2@0 -5.08,21.59; 2@1 17.78,21.59; 3.3V -27.94,-26.67; 3@0 -7.62,21.59; 3@1 15.24,21.59; 4 -10.16,21.59; 5 -12.7,21.59; 5V -25.4,-26.67; 6 -15.24,21.59; 7 -17.78,21.59; 8 -21.844,21.59; 9 -24.384,21.59; 10 -26.924,21.59; 11@0 -29.464,21.59; 12@0 -32.004,21.59; 13@0 -34.544,21.59; 14 10.16,-26.67; 15 12.7,-26.67; 16 15.24,-26.67; 17 17.78,-26.67; 18 20.32,-26.67; 19 22.86,-26.67; 20@0 25.4,-26.67; 20@1 20.32,21.59; 21@0 27.94,-26.67; 21@1 22.86,21.59; 22 5.08,21.59; 23 7.62,21.59; !ISP_RESET 0,-3.81; !RESET@0 -30.48,-26.67; A0 -12.7,-26.67; A1 -10.16,-26.67; A2 -7.62,-26.67; A3 -5.08,-26.67; A4/SDA -2.54,-26.67; A5/SCL 0,-26.67; A6 2.54,-26.67; A7 5.08,-26.67; AREF -39.624,21.59; GND@0 -22.86,-26.67; GND@1 -20.32,-26.67; GND@2 -37.084,21.59; GND@3 2.54,-3.81; IOREF -33.02,-26.67; ISP_MOSI 2.54,-1.27; ISP_SCK 0,-1.27; ISP_VCC 2.54,1.27; NC -35.56,-26.67; NC@0 12.7,21.59; NC@1 10.16,21.59; SCL -44.704,21.59; SDA -42.164,21.59; VIN -17.78,-26.67 | drill 1.016 pad 1.88 square: ISP_MISO 0,1.27
PAD = drill 1.016 pad 1.88: 1 0,0
22-23-2071 = drill 1 long: 1 -7.62,0; 2 -5.08,0; 3 -2.54,0; 4 0,0; 5 2.54,0; 6 5.08,0; 7 7.62,0
CON-HARTING-ML10 = drill 0.914 octagon: 1 -5.08,-1.27; 2 -5.08,1.27; 3 -2.54,-1.27; 4 -2.54,1.27; 5 0,-1.27; 6 0,1.27; 7 2.54,-1.27; 8 2.54,1.27; 9 5.08,-1.27; 10 5.08,1.27
USB-B-PTH-VERTICAL = drill 0.92 pad 1.676: D+ -1.25,0; D- -1.25,3.2; GND 1.25,0; VBUS 1.25,3.2 | drill 2.3: P$1 -6.02,0.5; P$2 6.02,0.5
SMA-THD = drill 1.549 pad 2.794: GND@0 -2.54,2.54; GND@1 2.54,2.54; GND@2 2.54,-2.54; GND@3 -2.54,-2.54; SIG 0,0
CONN-UFL-HAND-SOLDERING = smd 2.134 x 2.235: GND@0 -2.032,0; GND@1 2.032,0 | smd 1.016 x 3.048: SIGNAL 0,-2.54
MICRO-SD-SOCKET-HIROSE-DM3D = smd 0.7 x 2.75: CD/DAT3 6.6,-1.375; CLK 3.3,-1.375; CMD 5.5,-1.375; DAT0 1.1,-1.375; DAT1 0,-1.375; DAT2 7.7,-1.375; GND 2.2,-1.375; VDD 4.4,-1.375 | smd 1.8 x 1.3: P$11 -1.95,6.85 | smd 2.45 x 0.8: P$12 -1.625,8.35 | smd 1.8 x 1.4: P$13 11,7.5 | smd 2 x 1.55: P$14 10.6,9.925 | smd 2.5 x 1.5: SHIELD@0 10.65,-0.75 | smd 2.1 x 1.5: SHIELD@1 -1.9,-0.75
RJ45-8 = drill 1 pad 1.88 square: 1 -4.445,6.35 | drill 1 pad 1.88: 2 -3.175,8.89; 3 -1.905,6.35; 4 -0.635,8.89; 5 0.635,6.35; 6 1.905,8.89; 7 3.175,6.35; 8 4.445,8.89 | hole 3.2: -5.715,0; 5.715,0
RJ11-6 = drill 1.016 pad 1.88: 1 1.905,8.89; 2 3.175,6.35; 3 4.445,8.89; 4 5.715,6.35; 5 6.985,8.89; 6 8.255,6.35 | hole 3.251: 0,0; 10.16,0
22-23-2021 = drill 1 long: 1 -1.27,0; 2 1.27,0
TC38H = drill 0.813 pad 1.676: 1 -1.27,0; 2 1.27,0
HC49U-V-RESONATOR = drill 0.813 pad 1.88: 1 -2.54,0; 2 2.54,0; GND 0,0

### Placement (x,y rotation side)
BAT1  142.24,13.97 180 top
BOX1  107.95,62.23 0 top
C1  64.77,37.78 0 top
C2  69.85,29.21 90 top
C3  136.53,48.26 270 top
C4  145.41,48.26 270 top
C5  86.36,69.22 270 top
C6  119.38,100.33 270 top
C7  87,94.62 180 top
C8  90.81,24.45 180 top
C9  81.28,69.22 270 top
C10  80.64,100.33 180 top
C11  74.3,100.33 0 top
C12  90.81,28.57 0 top
C13  77.47,16.51 0 top
C14  132.08,97.79 90 top
C15  113.03,43.18 0 top
C16  106.68,43.18 180 top
C17  142.88,40 270 top
C18  135.25,40 270 top
C19  105.41,22.86 180 top
C20  115.57,33.02 270 top
C21  19.05,27.94 180 top
C22  19.05,34.92 0 top
C23  31.75,60.96 270 top
C24  41.91,68.58 90 top
C25  52.07,68.58 90 top
C26  21.59,60.96 270 top
C27  55.88,22.86 270 top
C28  35.56,45.47 180 top
C29  48.9,16.51 0 top
C30  35.56,48.01 180 top
C31  13.97,38.1 180 top
C32  13.97,43.18 0 top
C33  21.59,68.58 90 top
C34  52.07,60.96 270 top
C35  31.75,68.58 90 top
C36  41.91,60.96 270 top
C37  31.75,78.74 270 top
C38  36.83,78.74 270 top
D1  124.46,97.79 270 top
D2  146.05,31.11 90 top
D3  129.54,31.11 90 top
D4  20.32,102.87 270 top
DP1  115.57,17.78 270 top
IC1  63.5,30.48 90 top
IC2  140.97,48.26 0 top
IC3  36.83,64.77 90 top
IC4  82.55,82.55 180 top
IC5  106.05,33.02 180 top
IC6  81.28,27.94 180 top
IC7  26.67,64.77 90 top
IC8  46.99,64.77 90 top
IC9  57.15,64.77 90 top
IC10  34.29,85.09 90 top
JP1  124.46,68.58 270 top
JP4  96.52,101.6 0 top
JP5  73.66,40.64 0 top
JP6  2.54,45.72 270 top
JP7  91.44,40.64 180 top
JP8  119.38,91.44 90 top
JP9  86.36,40.64 180 top
JP10  45.72,52.07 0 top
JP11  50.8,76.2 180 top
JP12  2.54,68.58 90 top
JP13  2.54,63.5 270 top
L1  76.2,69.85 180 top
L2  77.47,13.33 180 top
L3  15.24,31.11 270 top
LED1  50.8,107.95 90 top
LED2  45.72,107.95 90 top
Q1  64.77,102.87 270 top
Q3  27.94,102.87 180 top
R1  50.8,101.6 270 top
R2  45.72,101.6 270 top
R3  128.91,68.58 90 top
R4  137.79,68.58 90 top
R5  133.35,68.58 90 top
R6  128.91,97.79 270 top
R7  146.69,40 90 top
R8  146.05,23.49 90 top
R9  99.06,43.18 180 top
R10  64.77,107.95 0 top
R11  46.99,71.12 180 top
R12  26.67,71.12 180 top
R13  36.83,58.42 0 top
R14  41.91,82.55 270 top
R15  45.72,82.55 270 top
R16  22.86,82.55 270 top
R17  26.67,82.55 270 top
R18  123.19,34.29 0 top
R19  123.19,29.21 0 top
R20  27.94,110.49 0 top
R21  57.15,95.25 180 top
RF1  39.37,31.75 180 top
S1  145.41,99.06 270 top
SENS1  125.73,48.26 0 top
U$1  116.84,85.09 0 top
U$2  40.64,17.78 270 top
U$3  35.56,17.78 270 top
U$4  55.88,45.72 270 top
U$5  55.88,43.18 270 top
U$6  40.64,48.26 270 top
U$7  43.18,48.26 270 top
U$8  45.72,48.26 270 top
U$9  48.26,48.26 270 top
U$10  50.8,48.26 270 top
X1  91.44,50.8 0 top
X2  71.12,49.53 0 top
X3  89.53,16.51 180 top
X4  7.62,27.94 270 top
X5  15.24,22.22 180 top
X6  139.7,78.74 90 top
X7  3.81,83.19 270 top
X8  3.81,105.41 270 top
X9  36.83,109.22 180 top
Y1  139.06,41.91 180 top
Y2  77.47,95.88 180 top
Y3  109.86,48.26 180 top

### Tracks (layer width: path | path; a pad name or v marks a point on that pad's centre or on a via)
0(RX0)  (2 unrouted)
1(TX0)  (2 unrouted)
2(RX1)  (3 unrouted)
3(TX1)  (4 unrouted)
4  (1 unrouted)
5  (1 unrouted)
6  (3 unrouted)
7  (2 unrouted)
8  (2 unrouted)
9  (1 unrouted)
10  (1 unrouted)
11(MOSI)  (3 unrouted)
12(MISO)  (3 unrouted)
13(SCK)  (5 unrouted)
14  (1 unrouted)
15  (2 unrouted)
16(TDI)  (2 unrouted)
17(TDO)  (2 unrouted)
18(TMS)  (2 unrouted)
19(TCK)  (2 unrouted)
20(SDA)  (7 unrouted)
21(SCL)  (7 unrouted)
22  (2 unrouted)
23  (1 unrouted)
!GPS_RESET  (1 unrouted)
!MCP2200_RESET  (1 unrouted)
!RESET  (8 unrouted)
+3V3  (19 unrouted)
  Top 0.381: 36.83,45.72 36.83,48.26 C30.1 37.08,48.26 37.34,48.51 37.47,48.26 | 36.83,45.72 36.83,42.42 RF1.P$8 | 36.83,45.72 C28.1 | RF1.P$26 47.24,21.21 47.24,16.51 C29.1 | IC5.17 107.95,22.86 C19.1 | IC7.1 21.59,63.12 C26.1 | IC3.6 31.75,66.42 C35.1 | IC8.1 41.91,63.12 C36.1 | IC9.6 52.07,66.42 C25.1
+5V  (7 unrouted)
+5V_USB  (3 unrouted)
A0  (1 unrouted)
  Top 0.254: U$1.A0 104.14,59.05 88.9,74.29 IC4.33
A1
  Top 0.254: U$1.A1 106.68,59.05 91.44,74.29 IC4.34
A2  (3 unrouted)
  Top 0.254: U$1.A2 109.22,59.05 93.98,74.29 IC4.35
A3
  Top 0.254: U$1.A3 111.76,59.05 96.52,74.29 IC4.36
A4
  Top 0.254: U$1.A4/SDA 114.3,59.05 99.06,74.29 IC4.37
A5
  Top 0.254: U$1.A5/SCL 116.84,59.05 101.6,74.29 IC4.38
A6  (1 unrouted)
  Top 0.254: U$1.A6 119.38,59.05 104.14,74.29 IC4.39
A7  (1 unrouted)
  Top 0.254: U$1.A7 121.92,59.05 106.68,74.29 IC4.40
AREF  (2 unrouted)
  Top 0.381: IC4.32 86.36,70.48
AUTO_RESET  (1 unrouted)
AVCC  (2 unrouted)
  Top 0.381: IC4.30 81.28,70.48 77.47,70.48 77.47,69.85 78.11,69.85
FAN_CTRL  (3 unrouted)
GND  (via drill 0.51)  (91 unrouted)
  Top 0.381: X4.GND@1 v10.16,22.22 X5.GND@1 13.34,22.22 13.34,20.57 17.14,20.57 17.14,22.22 X5.GND@0 17.27,22.86 25.4,22.86 | 30.48,20.95 29.21,20.95 | 29.21,20.95 25.4,20.95 25.4,22.86 | 29.21,20.95 RF1.P$17 | 30.48,20.95 34.92,20.95 RF1.P$19 34.8,21.34 34.8,23.37 42.93,23.37 | 30.48,20.95 RF1.P$18 | 25.4,26.67 25.91,26.42 RF1.P$16 25.4,26.67 | 21.59,35.81 25.65,35.81 RF1.P$13 | C22.2 21.59,34.92 21.59,35.81 | RF1.P$13 25.4,35.85 25.4,28.75 RF1.P$14 25.91,28.7 27.94,28.7 27.94,26.67 25.4,26.67 | 25.4,36.83 25.4,36.07 RF1.P$13 | 30.1,42.54 29.21,42.54 | 29.21,42.54 RF1.P$11 28.96,42.54 | RF1.P$9 35.56,42.54 34.29,42.54 | 34.29,42.54 30.1,42.54 | 30.1,42.54 RF1.P$10 | 28.96,42.54 29.21,42.54 | 25.4,36.83 25.4,42.54 28.96,42.54 | 25.4,36.83 RF1.P$12 | 25.4,26.67 25.4,22.86 | 50.8,37.08 52.83,37.08 RF1.P$34 | 50.8,27.69 50.8,37.08 | 50.8,27.69 52.83,27.69 RF1.P$29 | 50.8,37.08 50.8,39.62 50.29,40.13 46.23,40.13 46.23,42.16 RF1.P$3 | 51.05,16.51 50.8,16.51 | 50.8,16.51 C29.2 | IC8.2 IC8.5 | 42.93,23.37 42.93,21.34 RF1.P$22 | 44.96,23.37 42.93,23.37 | 44.96,23.37 44.96,21.34 RF1.P$24 | 48.51,21.34 50.8,21.34 | 50.8,21.34 55.88,21.34 C27.2 | 48.51,21.34 RF1.P$27 | 44.96,23.37 48.51,23.37 48.51,21.34 | 50.8,21.34 50.8,27.69 | 34.29,45.72 34.29,48.26 C30.2 | 34.29,42.54 34.29,45.72 | 34.29,45.72 C28.2 | IC5.20 111.76,31.75 115.57,31.75 C20.2 | 50.8,21.34 50.8,20.32 | 50.8,20.32 50.8,16.51 | v52.07,20.32 50.8,20.32 | 142.88,45.49 IC2.4 142.88,45.72 145.41,45.72 C4.2 | 21.59,35.81 v21.59,38.1 | C32.2 12.7,38.1
  Top 0.406: IC4.11 85.5,94.39 C7.2 | Y2.GND 77.47,100.33 | 77.47,100.33 C11.2 | C10.2 77.47,100.33
  Bottom 0.381: X4.GND@0 X4.GND@3 X4.GND@2 X4.GND@1
  Bottom 0.406: Y2.GND 77.47,95.25 81.28,91.44 IC4.11
  other vias: 12.7,19.05 2.54,35.56 7.62,38.1 7.62,49.53 19.05,43.18 17.78,30.48 24.77,24.76 24.77,30.48 17.78,19.05 17.78,49.53 33.02,43.18 21.59,24.76 28.57,27.5 28.57,24.76 28.57,30.48 21.59,30.48 34.92,24.76 34.92,27.3 34.92,30.48 34.92,35.56 12.7,49.53 20.32,21.59 17.78,38.1
  pour Top (isolate 0.61): 134.62,39.37 143.51,39.37 143.51,31.75 134.62,31.75
GPIO0
  Top 0.254: U$3.1 35.81,17.78 35.81,21.08 RF1.P$20
GPIO1  (1 unrouted)
  Top 0.254: U$4.1 47.24,45.72 47.24,42.42 RF1.P$2
GPIO2
  Top 0.254: U$5.1 49.28,43.18 48.51,42.42 RF1.P$1
GPIO3
  Top 0.254: RF1.P$6 42.67,42.16 42.67,40.13 41.4,40.13 40.64,40.89 U$6.1 JP10.1
GPIO4
  Top 0.254: RF1.P$7 41.91,42.42 41.91,46.99 U$7.1 JP10.3
GPIO5  (via drill 0.51)
  Top 0.254: v45.21,45.72 45.21,42.42 RF1.P$4 | U$8.1 JP10.5
  Bottom 0.254: v45.21,45.72 45.72,46.23 U$8.1
GPIO6  (1 unrouted)
  Top 0.254: U$9.1 JP10.7
GPIO7
  Top 0.254: RF1.P$5 44.2,42.42 44.2,46.74 49.28,46.74 U$10.1 JP10.9
GPS_RX1  (1 unrouted)
  Top 0.254: 54.61,36.07 53.09,36.07 RF1.P$33
GPS_TX1  (1 unrouted)
  Top 0.254: 54.36,34.8 53.09,34.8 RF1.P$32
MAG_SCL  (3 unrouted)
MAG_SDA  (3 unrouted)
MAG_VCC  (6 unrouted)
  Top 0.381: IC10.8 31.75,83.19 C37.1
N$1  (1 unrouted)
  Top 0.406: IC4.13 76.2,92.71 74.93,93.98 Y2.2 73.66,97.16 73.66,100.33
N$2  (1 unrouted)
  Top 0.406: IC4.12 78.74,92.71 80.01,93.98 Y2.1 81.28,97.16 81.28,100.33
N$3  (1 unrouted)
N$4  (1 unrouted)
N$5  (2 unrouted)
  Top 0.254: 139.06,45.72 139.06,45.08 137.79,43.81 Y1.2 135.25,41.91 135.25,41.27
N$6  (1 unrouted)
N$7
  Top 0.254: IC5.3 109.22,43.18 C16.1 107.91,47.67 Y3.2
N$8  (1 unrouted)
N$9  (1 unrouted)
N$11  (1 unrouted)
  Top 0.381: IC2.3 141.6,48.26 143.13,48.26 144.15,49.28 145.41,49.28 145.41,49.53 144.78,49.53 C4.1 147.96,49.76 147.96,43.18 146.69,43.18 R7.2
N$12  (2 unrouted)
  Top 0.254: 140.34,45.72 Y1.1 142.88,41.91 142.88,41.27
N$14  (1 unrouted)
N$15  (1 unrouted)
N$18
  Top 0.254: IC5.2 110.49,43.18 C15.1 111.81,47.67 Y3.1
N$22  (2 unrouted)
N$23
  Top 0.762: 17.02,27.94 C21.2
  Top 0.813: X4.SIG 12.19,27.94
  Top 1.016: X5.SIGNAL 15.24,27.94
  Top 1.524: 15.24,27.94 L3.2
  Top 2.311: 12.19,27.94 15.24,27.94 17.02,27.94
N$24
  Top 0.66: 22.61,27.94 22.86,27.65 RF1.P$15
  Top 0.762: 21.08,27.94 C21.1
  Top 2.311: 22.61,27.94 21.08,27.94
N$25  (1 unrouted)
N$26  (1 unrouted)
N$29  (2 unrouted)
PPS  (1 unrouted)
SLEEP_FLAG
  Top 0.254: U$2.1 41.66,17.78 41.66,21.08 RF1.P$21
SQW  (2 unrouted)
USB_D+  (via drill 0.6)
  Top 0.254: IC5.19 v110.49,20.32
  Bottom 0.254: X3.D+ 91.44,16.51 91.44,20.32 v110.49,20.32
USB_D-  (via drill 0.6)
  Top 0.254: v109.22,19.05 IC5.18
  Bottom 0.254: X3.D- 91.42,13.94 92.71,15.24 92.71,17.78 93.98,19.05 v109.22,19.05
V_ANT  (2 unrouted)
  Top 0.381: L3.1 15.24,34.92 | 15.24,34.92 15.24,37.87 C31.1 | C22.1 15.24,34.92 | C32.1 15.24,38.1
V_BACKUP  (1 unrouted)
VBATT  (4 unrouted)
VBUS  (1 unrouted)
VCC  (28 unrouted)
  Top 0.381: IC5.1 111.76,34.29 115.57,34.29 C20.1 | IC7.6 21.59,66.42 C33.1 | IC3.1 31.75,63.12 C23.1 | IC8.6 41.91,66.42 C24.1 | IC9.1 52.07,63.12 C34.1 | IC10.1 36.83,83.19 C38.1 | IC2.8 136.53,50.88 C3.1
  Top 0.406: IC4.10 83.82,90.81 85.72,92.71 87.63,92.71 88.49,93.57 C7.1
VIN  (8 unrouted)

### Text on the board
tPlace: TX1 | RX1 | TX0 | RX0 | TX1 | RX1 | SDA | SCL
tNames: Check footprint of RJ45/RJ11 | Use TO-220 for LD117 / Move decoupling caps for it | RESET | S/N: | CLOCK:
tValues: 3V3 | VIN | PPS 7 | JP4: / PPS / PIN | PPS 6 | FAN | POWER | STATUS | 7/6 | FAN | 3V3/VIN | 3V3 | 5V | 3V3/5V | AUTO / RESET | GPS / ANTENNA | USB | 3V3 | 3V3 | JP5: MCU / OPERATION | MHz | JP9: POWER / SOURCE | 5V | 5V
tSilk: 3 / H | 4 / H | 5 / H | 6 / L | 7 / L | GPIO1 | GPIO2 | GPIO0 | SLEEP / FLAG
_tsilk: 4 | 3 | 2 | SCL | SDA | AREF | GND | 13 | 12 | 11 | 10 | 9 | 8 | 7 | 6 | 5 | 1 | 0 | 22 | 23 | NC | NC | 3 | 2 | 20 | 21 | GPS / RESET | µSD: 3V3 / operation only | NC | IOREF | !RESET | 3V3 | 5V | GND | GND | Vin | A0 | A1 | A2 | A3 | A4 | A5 | A6 | A7 | 14 | 15 | 16 | 17 | 18 | 19 | 20 | 21 | MCU | PWR SRC